# Altium project VOU_SOM_CV_V0.0.1.PrjPcb (part 1 of 2)
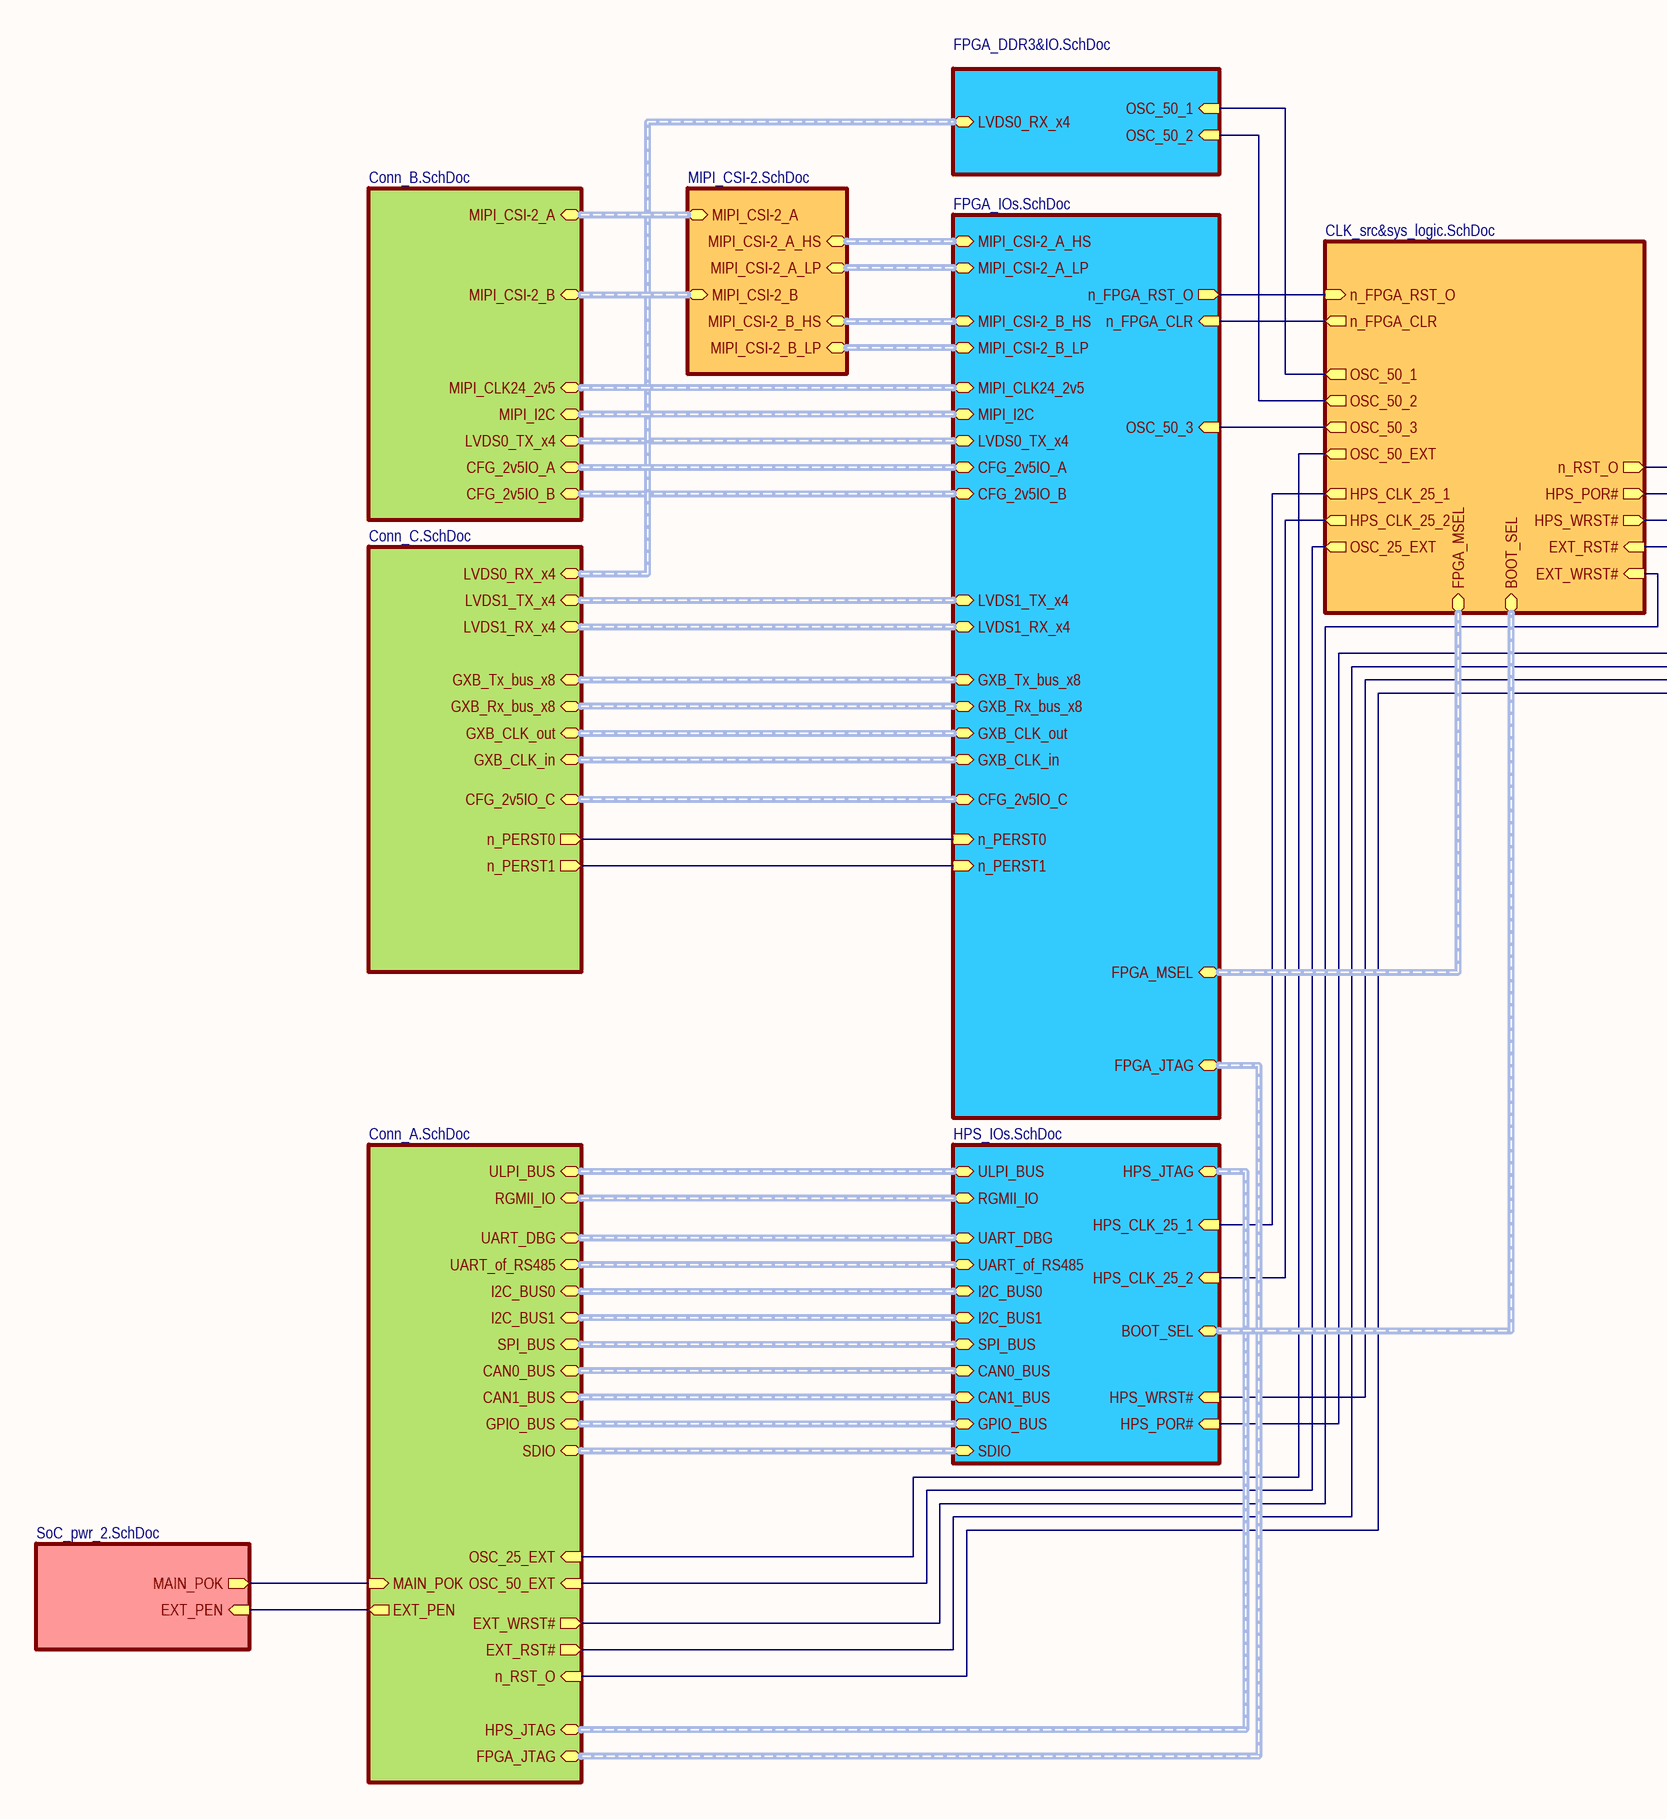
[diagram p0: VOU_SOM_CV_V0.0.1.SchDoc, left]
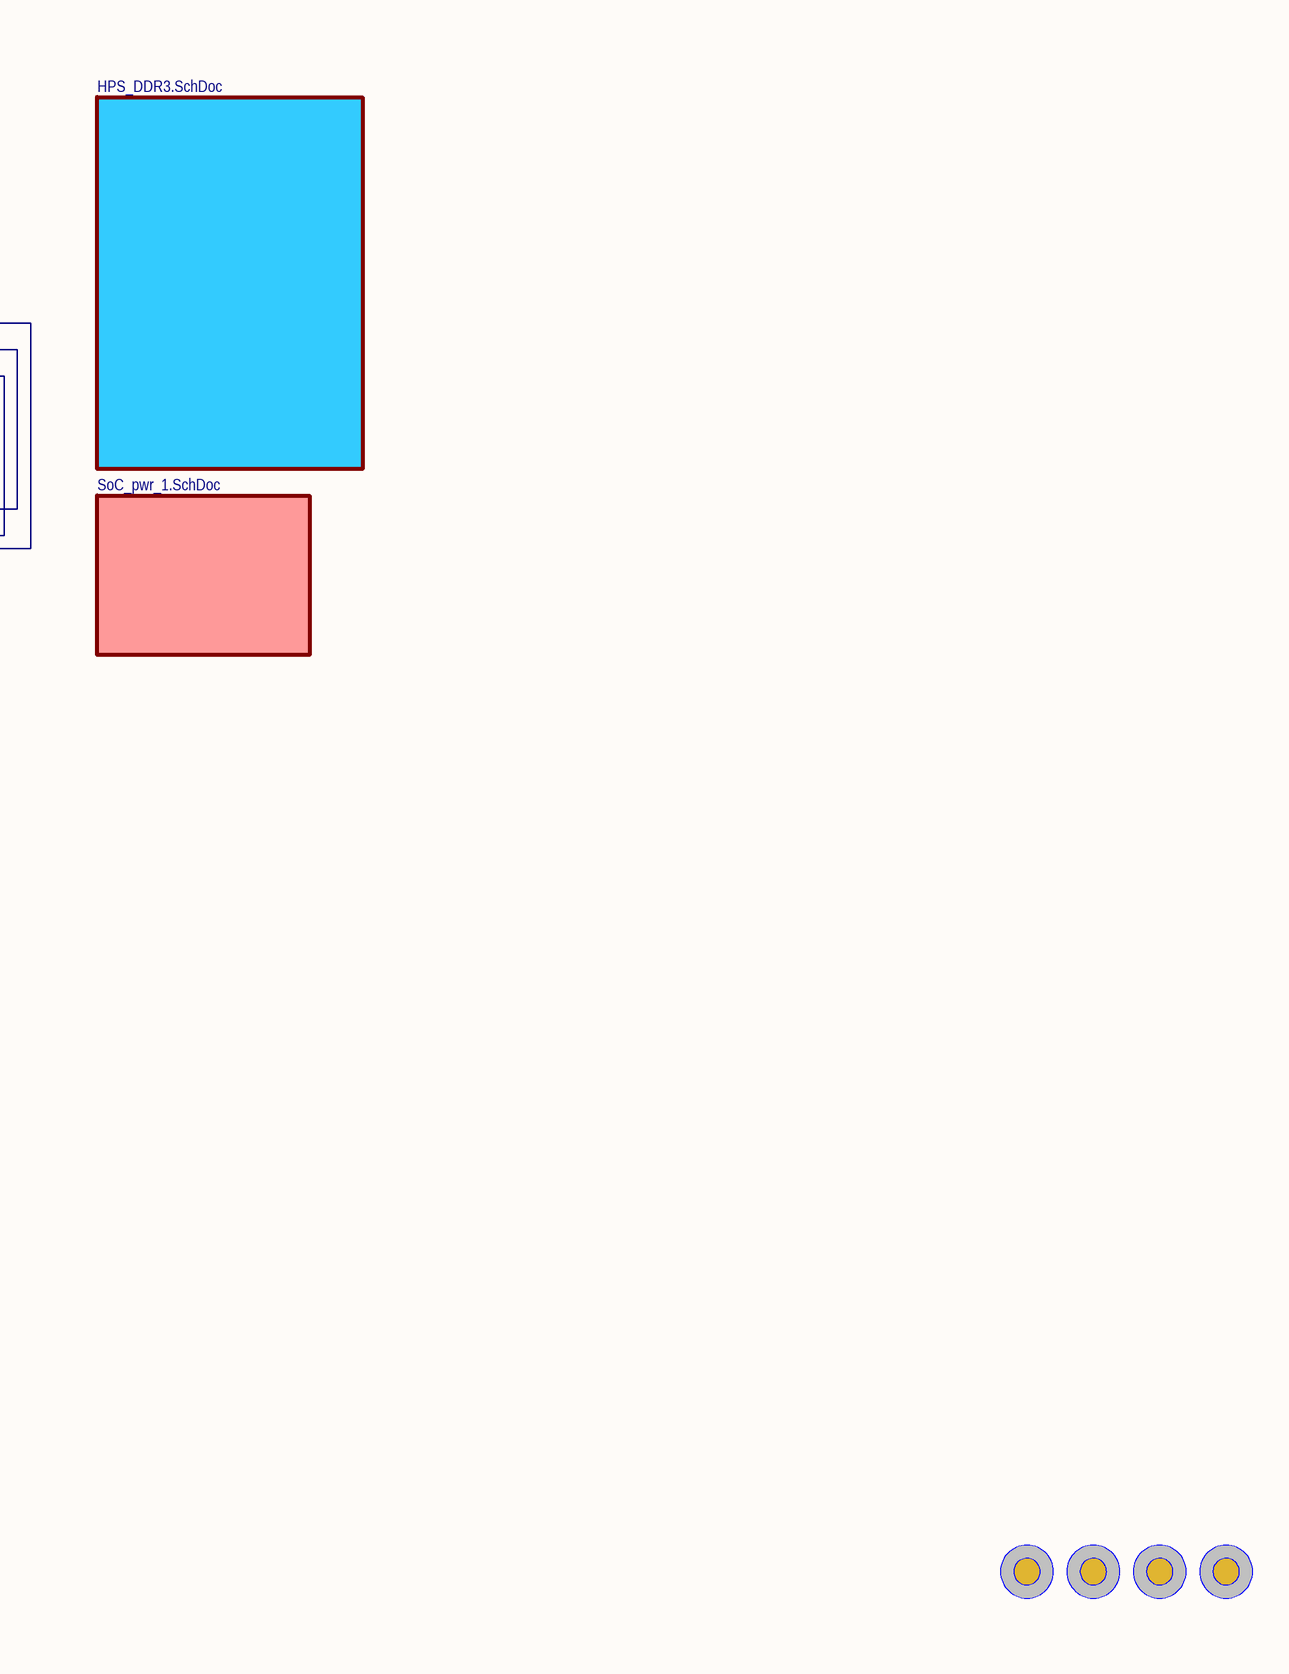
[diagram p1: VOU_SOM_CV_V0.0.1.SchDoc, right]
8 sheets, 208 parts. Net scope: hierarchical (ports join the sheet entries above them; power ports are global).
Board file: VOU_SOM_CV_V0.0.1.PcbDoc
Sheets:
  VOU_SOM_CV_V0.0.1.SchDoc
    FPGA_DDR3&IO.SchDoc = FPGA_DDR3&IO.SchDoc
    Conn_A.SchDoc = Conn_A.SchDoc
    Conn_B.SchDoc = Conn_B.SchDoc
    Conn_C.SchDoc = Conn_C.SchDoc
    HPS_DDR3.SchDoc = HPS_DDR3.SchDoc
    CLK_src&sys_logic.SchDoc = CLK_src&sys_logic.SchDoc
    SoC_pwr_2.SchDoc = SoC_pwr_2.SchDoc

## Sheet VOU_SOM_CV_V0.0.1.SchDoc
size 593 x 419 mm; DocumentNumber: 1; SheetNumber: 1; SheetTotal: 12; Razrabotal: Савицкий

### Parts
RP_BL  Comment  [Reper-Normal]  (value not drawn)  (no BOM)
RP_BR  Comment  [Reper-Normal]  (value not drawn)  (no BOM)
RP_LT  Comment  [Reper-Normal]  (value not drawn)  (no BOM)
RP_RT  Comment  [Reper-Normal]  (value not drawn)  (no BOM)

### Sub-sheets
CLK_src&sys_logic.SchDoc = CLK_src&sys_logic.SchDoc: HPS_CLK_25_1 (out), HPS_CLK_25_2 (out), OSC_50_1 (out), OSC_50_2 (out), OSC_50_3 (out), OSC_50_EXT (out), OSC_25_EXT (out), EXT_RST# (in), HPS_WRST# (out), HPS_POR# (out), FPGA_MSEL (harness FPGA_MSEL), BOOT_SEL (harness BOOT_SEL), n_FPGA_RST_O (in), n_FPGA_CLR (out), EXT_WRST# (in), n_RST_O (out)
Conn_A.SchDoc = Conn_A.SchDoc: MAIN_POK (in), EXT_PEN (out), ULPI_BUS (harness ULPI_BUS), RGMII_IO (harness RGMII_IO), UART_DBG (harness UART_DBG), UART_of_RS485 (harness UART_of_RS485), I2C_BUS0 (harness I2C_BUS0), I2C_BUS1 (harness I2C_BUS1), SPI_BUS (harness SPI_BUS), CAN0_BUS (harness CAN0_BUS), GPIO_BUS (harness GPIO_BUS), SDIO (harness SDIO), OSC_50_EXT (in), OSC_25_EXT (in), n_RST_O (in), HPS_JTAG (harness HPS_JTAG), FPGA_JTAG (harness FPGA_JTAG), EXT_RST# (out), EXT_WRST# (out), CAN1_BUS (harness CAN1_BUS)
Conn_B.SchDoc = Conn_B.SchDoc: MIPI_CSI-2_A (harness MIPI_CSI-2_A), MIPI_CSI-2_B (harness MIPI_CSI-2_B), LVDS0_TX_x4 (harness LVDS0_TX_x4), MIPI_I2C (harness MIPI_I2C), MIPI_CLK24_2v5 (harness MIPI_CLK24_2v5), CFG_2v5IO_A (harness CFG_2v5IO_A), CFG_2v5IO_B (harness CFG_2v5IO_B)
Conn_C.SchDoc = Conn_C.SchDoc: GXB_Tx_bus_x8 (harness GXB_Tx_bus_x8), GXB_Rx_bus_x8 (harness GXB_Rx_bus_x8), LVDS0_RX_x4 (harness LVDS0_RX_x4), LVDS1_TX_x4 (harness LVDS1_TX_x4), LVDS1_RX_x4 (harness LVDS1_RX_x4), GXB_CLK_out (harness GXB_CLK_out), GXB_CLK_in (harness GXB_CLK_in), CFG_2v5IO_С (harness CFG_2v5IO_С), n_PERST0 (out), n_PERST1 (out)
DIMS_DSP_MainBoard_Interface.SchDoc = MIPI_CSI-2.SchDoc (file not in this document): MIPI_CSI-2_B_HS (harness MIPI_CSI-2_B_HS), MIPI_CSI-2_B_LP (harness MIPI_CSI-2_B_LP), MIPI_CSI-2_A_HS (harness MIPI_CSI-2_A_HS), MIPI_CSI-2_A_LP (harness MIPI_CSI-2_A_LP), MIPI_CSI-2_A (harness MIPI_CSI-2_A), MIPI_CSI-2_B (harness MIPI_CSI-2_B)
FPGA_DDR3&IO.SchDoc = FPGA_DDR3&IO.SchDoc: OSC_50_1 (in), OSC_50_2 (in), LVDS0_RX_x4 (harness LVDS0_RX_x4)
FPGA_IOs.SchDoc = FPGA_IOs.SchDoc (file not in this document): MIPI_CSI-2_B_LP (harness MIPI_CSI-2_B_LP), MIPI_CSI-2_A_LP (harness MIPI_CSI-2_A_LP), MIPI_CSI-2_A_HS (harness MIPI_CSI-2_A_HS), CFG_2v5IO_B (harness CFG_2v5IO_B), GXB_Tx_bus_x8 (harness GXB_Tx_bus_x8), GXB_Rx_bus_x8 (harness GXB_Rx_bus_x8), GXB_CLK_out (harness GXB_CLK_out), FPGA_JTAG (harness FPGA_JTAG), FPGA_MSEL (harness FPGA_MSEL), OSC_50_3 (in), MIPI_CLK24_2v5 (harness MIPI_CLK24_2v5), MIPI_CSI-2_B_HS (harness MIPI_CSI-2_B_HS), MIPI_I2C (harness MIPI_I2C), LVDS0_TX_x4 (harness LVDS0_TX_x4), LVDS1_TX_x4 (harness LVDS1_TX_x4), LVDS1_RX_x4 (harness LVDS1_RX_x4), GXB_CLK_in (harness GXB_CLK_in), CFG_2v5IO_A (harness CFG_2v5IO_A), CFG_2v5IO_С (harness CFG_2v5IO_С), n_PERST0 (in), n_PERST1 (in), n_FPGA_RST_O (out), n_FPGA_CLR (in)
HPS_DDR3.SchDoc = HPS_DDR3.SchDoc: no entries
HPS_IOs.SchDoc = HPS_IOs.SchDoc (file not in this document): ULPI_BUS (harness ULPI_BUS), RGMII_IO (harness RGMII_IO), UART_DBG (harness UART_DBG), UART_of_RS485 (harness UART_of_RS485), I2C_BUS0 (harness I2C_BUS0), I2C_BUS1 (harness I2C_BUS1), SPI_BUS (harness SPI_BUS), CAN0_BUS (harness CAN0_BUS), GPIO_BUS (harness GPIO_BUS), HPS_JTAG (harness HPS_JTAG), SDIO (harness SDIO), HPS_CLK_25_1 (in), HPS_CLK_25_2 (in), HPS_WRST# (in), HPS_POR# (in), BOOT_SEL (harness BOOT_SEL), CAN1_BUS (harness CAN1_BUS)
SoC_pwr_1.SchDoc = SoC_pwr_1.SchDoc (file not in this document): no entries
SoC_pwr_2.SchDoc = SoC_pwr_2.SchDoc: MAIN_POK (out), EXT_PEN (in)

### Nets
EXT_PEN: sheet Conn_A.SchDoc/EXT_PEN, sheet SoC_pwr_2.SchDoc/EXT_PEN
EXT_RST#: sheet Conn_A.SchDoc/EXT_RST#, sheet CLK_src&sys_logic.SchDoc/EXT_RST#
HPS_WRST#: sheet HPS_IOs.SchDoc/HPS_WRST#, sheet CLK_src&sys_logic.SchDoc/HPS_WRST#
MAIN_POK: sheet Conn_A.SchDoc/MAIN_POK, sheet SoC_pwr_2.SchDoc/MAIN_POK
n_PERST0: sheet Conn_C.SchDoc/n_PERST0, sheet FPGA_IOs.SchDoc/n_PERST0
n_PERST1: sheet Conn_C.SchDoc/n_PERST1, sheet FPGA_IOs.SchDoc/n_PERST1
N_RST_O: sheet Conn_A.SchDoc/n_RST_O, sheet CLK_src&sys_logic.SchDoc/n_RST_O
NetC9_1: sheet FPGA_DDR3&IO.SchDoc/OSC_50_1, sheet CLK_src&sys_logic.SchDoc/OSC_50_1
NetC10_1: sheet FPGA_DDR3&IO.SchDoc/OSC_50_2, sheet CLK_src&sys_logic.SchDoc/OSC_50_2
NetD1_1: sheet FPGA_IOs.SchDoc/n_FPGA_RST_O, sheet CLK_src&sys_logic.SchDoc/n_FPGA_RST_O
NetR6_2: sheet FPGA_IOs.SchDoc/OSC_50_3, sheet CLK_src&sys_logic.SchDoc/OSC_50_3
NetR7_2: sheet Conn_A.SchDoc/OSC_25_EXT, sheet CLK_src&sys_logic.SchDoc/OSC_50_EXT
NetR9_2: sheet HPS_IOs.SchDoc/HPS_CLK_25_1, sheet CLK_src&sys_logic.SchDoc/HPS_CLK_25_1
NetR10_2: sheet HPS_IOs.SchDoc/HPS_CLK_25_2, sheet CLK_src&sys_logic.SchDoc/HPS_CLK_25_2
NetR11_2: sheet Conn_A.SchDoc/OSC_50_EXT, sheet CLK_src&sys_logic.SchDoc/OSC_25_EXT
NetR12_2: sheet HPS_IOs.SchDoc/HPS_POR#, sheet CLK_src&sys_logic.SchDoc/HPS_POR#
NetR13_1: sheet Conn_A.SchDoc/EXT_WRST#, sheet CLK_src&sys_logic.SchDoc/EXT_WRST#
NetR143_2: sheet FPGA_IOs.SchDoc/n_FPGA_CLR, sheet CLK_src&sys_logic.SchDoc/n_FPGA_CLR

### Buses and harness runs
harness sheet CLK_src&sys_logic.SchDoc/BOOT_SEL = sheet HPS_IOs.SchDoc/BOOT_SEL
harness sheet CLK_src&sys_logic.SchDoc/FPGA_MSEL = sheet FPGA_IOs.SchDoc/FPGA_MSEL
harness sheet Conn_A.SchDoc/CAN0_BUS = sheet HPS_IOs.SchDoc/CAN0_BUS
harness sheet Conn_A.SchDoc/CAN1_BUS = sheet HPS_IOs.SchDoc/CAN1_BUS
harness sheet Conn_A.SchDoc/FPGA_JTAG = sheet FPGA_IOs.SchDoc/FPGA_JTAG
harness sheet Conn_A.SchDoc/GPIO_BUS = sheet HPS_IOs.SchDoc/GPIO_BUS
harness sheet Conn_A.SchDoc/HPS_JTAG = sheet HPS_IOs.SchDoc/HPS_JTAG
harness sheet Conn_A.SchDoc/I2C_BUS0 = sheet HPS_IOs.SchDoc/I2C_BUS0
harness sheet Conn_A.SchDoc/I2C_BUS1 = sheet HPS_IOs.SchDoc/I2C_BUS1
harness sheet Conn_A.SchDoc/RGMII_IO = sheet HPS_IOs.SchDoc/RGMII_IO
harness sheet Conn_A.SchDoc/SDIO = sheet HPS_IOs.SchDoc/SDIO
harness sheet Conn_A.SchDoc/SPI_BUS = sheet HPS_IOs.SchDoc/SPI_BUS
harness sheet Conn_A.SchDoc/UART_DBG = sheet HPS_IOs.SchDoc/UART_DBG
harness sheet Conn_A.SchDoc/UART_of_RS485 = sheet HPS_IOs.SchDoc/UART_of_RS485
harness sheet Conn_A.SchDoc/ULPI_BUS = sheet HPS_IOs.SchDoc/ULPI_BUS
harness sheet Conn_B.SchDoc/CFG_2v5IO_A = sheet FPGA_IOs.SchDoc/CFG_2v5IO_A
harness sheet Conn_B.SchDoc/CFG_2v5IO_B = sheet FPGA_IOs.SchDoc/CFG_2v5IO_B
harness sheet Conn_B.SchDoc/LVDS0_TX_x4 = sheet FPGA_IOs.SchDoc/LVDS0_TX_x4
harness sheet Conn_B.SchDoc/MIPI_CLK24_2v5 = sheet FPGA_IOs.SchDoc/MIPI_CLK24_2v5
harness sheet Conn_B.SchDoc/MIPI_CSI-2_A = sheet DIMS_DSP_MainBoard_Interface.SchDoc/MIPI_CSI-2_A
harness sheet Conn_B.SchDoc/MIPI_CSI-2_B = sheet DIMS_DSP_MainBoard_Interface.SchDoc/MIPI_CSI-2_B
harness sheet Conn_B.SchDoc/MIPI_I2C = sheet FPGA_IOs.SchDoc/MIPI_I2C
harness sheet Conn_C.SchDoc/CFG_2v5IO_С = sheet FPGA_IOs.SchDoc/CFG_2v5IO_С
harness sheet Conn_C.SchDoc/GXB_CLK_in = sheet FPGA_IOs.SchDoc/GXB_CLK_in
harness sheet Conn_C.SchDoc/GXB_CLK_out = sheet FPGA_IOs.SchDoc/GXB_CLK_out
harness sheet Conn_C.SchDoc/GXB_Rx_bus_x8 = sheet FPGA_IOs.SchDoc/GXB_Rx_bus_x8
harness sheet Conn_C.SchDoc/GXB_Tx_bus_x8 = sheet FPGA_IOs.SchDoc/GXB_Tx_bus_x8
harness sheet Conn_C.SchDoc/LVDS0_RX_x4 = sheet FPGA_DDR3&IO.SchDoc/LVDS0_RX_x4
harness sheet Conn_C.SchDoc/LVDS1_RX_x4 = sheet FPGA_IOs.SchDoc/LVDS1_RX_x4
harness sheet Conn_C.SchDoc/LVDS1_TX_x4 = sheet FPGA_IOs.SchDoc/LVDS1_TX_x4
harness sheet DIMS_DSP_MainBoard_Interface.SchDoc/MIPI_CSI-2_A_HS = sheet FPGA_IOs.SchDoc/MIPI_CSI-2_A_HS
harness sheet DIMS_DSP_MainBoard_Interface.SchDoc/MIPI_CSI-2_A_LP = sheet FPGA_IOs.SchDoc/MIPI_CSI-2_A_LP
harness sheet DIMS_DSP_MainBoard_Interface.SchDoc/MIPI_CSI-2_B_HS = sheet FPGA_IOs.SchDoc/MIPI_CSI-2_B_HS
harness sheet DIMS_DSP_MainBoard_Interface.SchDoc/MIPI_CSI-2_B_LP = sheet FPGA_IOs.SchDoc/MIPI_CSI-2_B_LP

### Notes on the sheet
- Перв. примен.
- Справ. №
- Подп. и дата
- Инв. № дубл.
- Взам. инв. №
- Изм.
- Лист
- № докум.
- Подп.
- Дата
- Лит.
- Масса
- Масштаб
- Разраб.
- Пров.
- Т.контр.
- Схема электрическая принципиальная
- Листов
- Инв. № подл.
- Н.контр.
- Утв.
- Копировал:
- Формат А2

### Library data of the parts
RP_BL RP_BR RP_LT RP_RT = Reper: Стабилизатор положительного напряжения

## Sheet FPGA_DDR3&IO.SchDoc
size A1
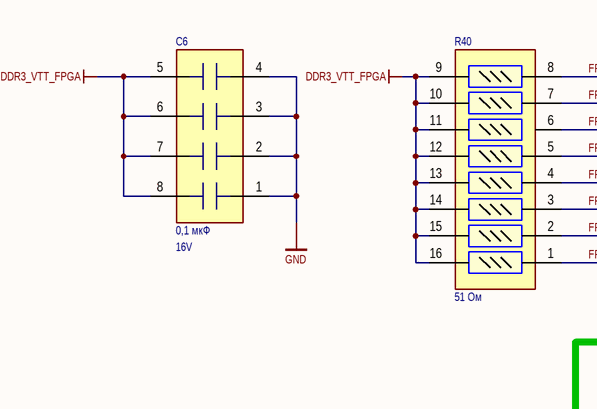
[diagram p2: FPGA_DDR3&IO.SchDoc, top left]
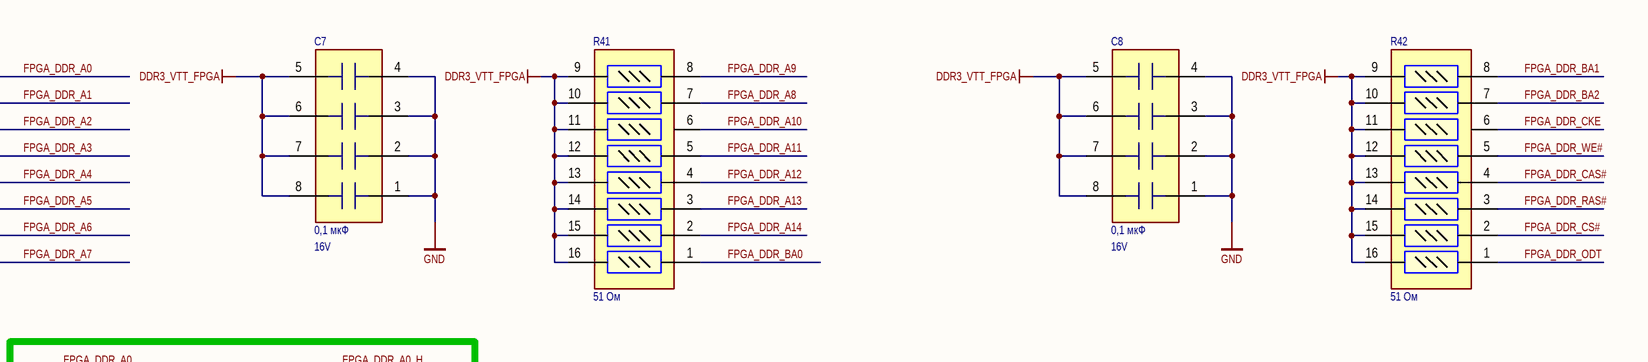
[diagram p3: FPGA_DDR3&IO.SchDoc, top right]
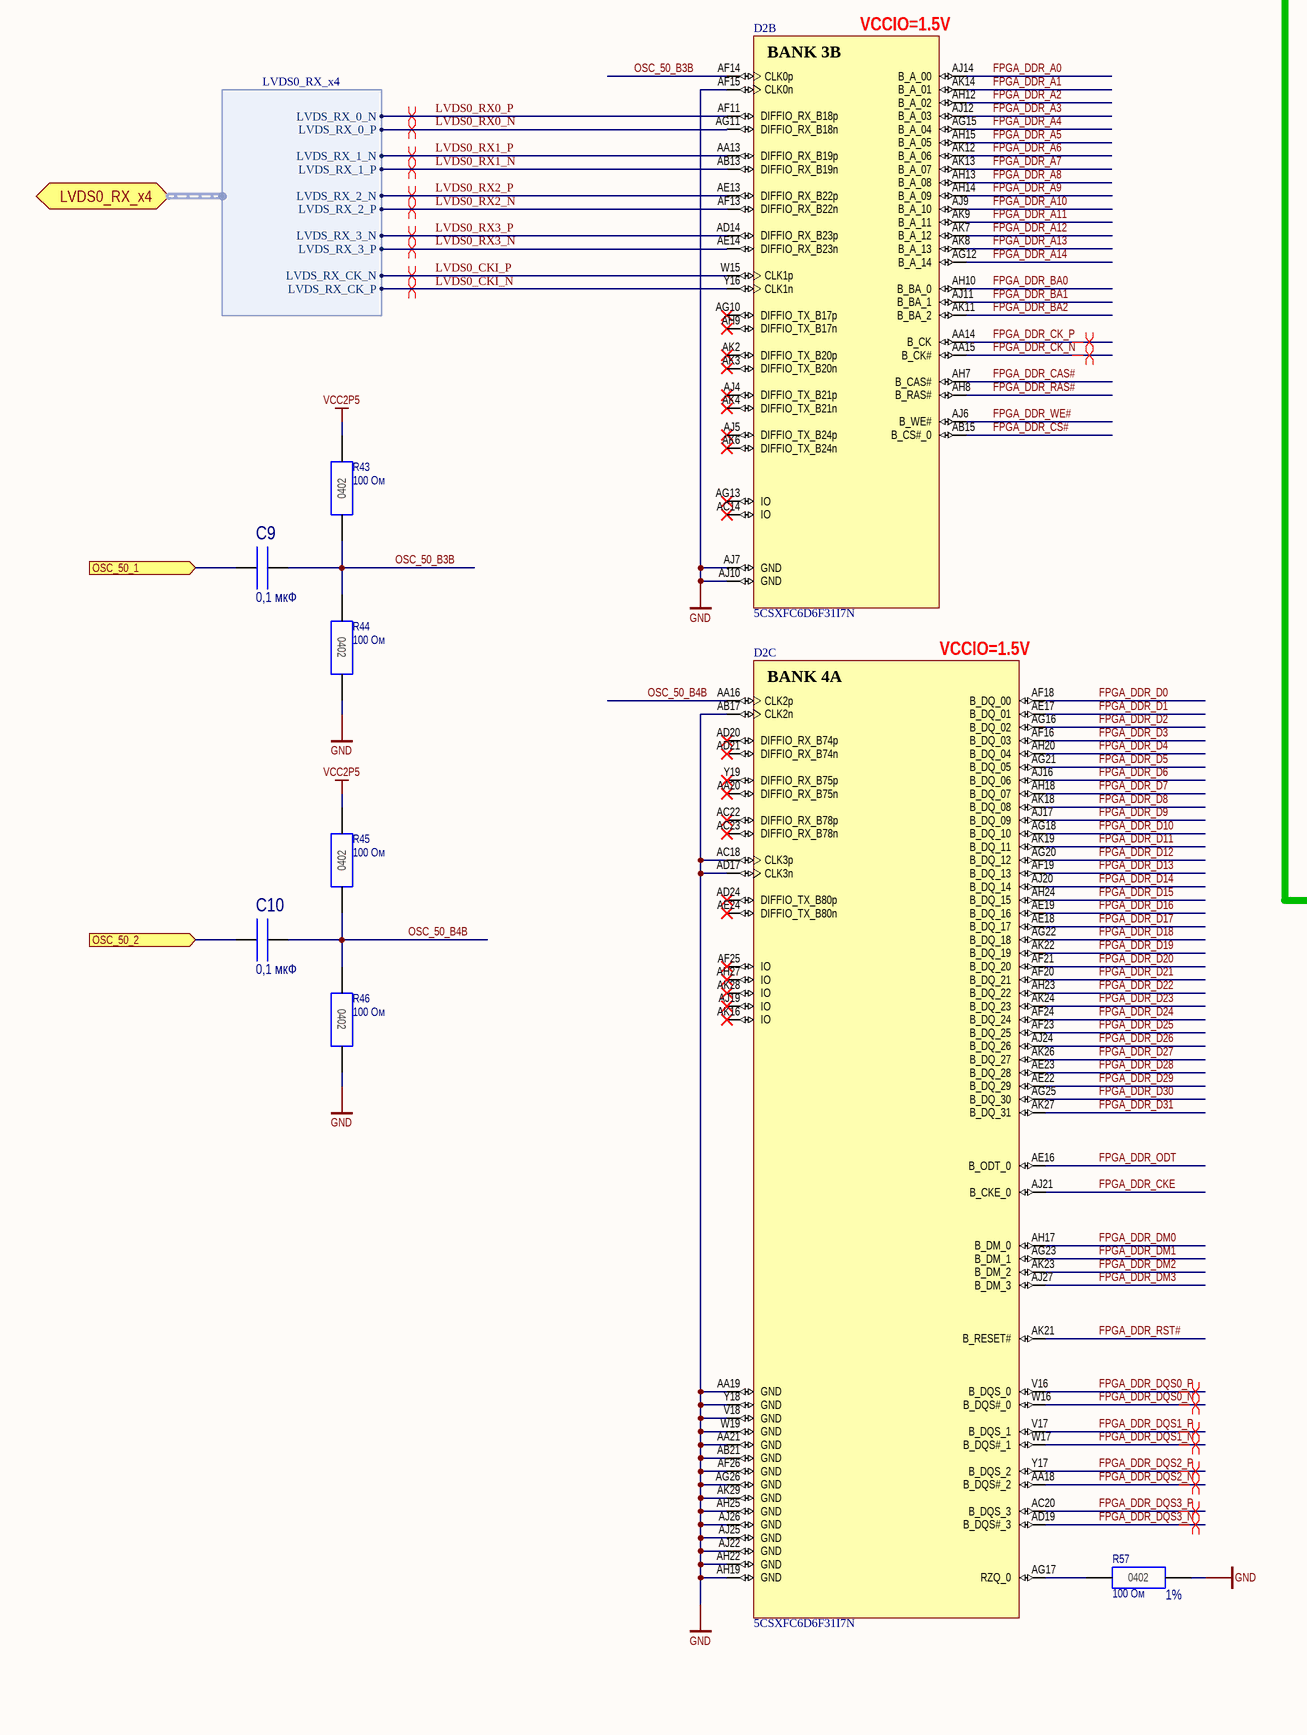
[diagram p4: FPGA_DDR3&IO.SchDoc, bottom left]
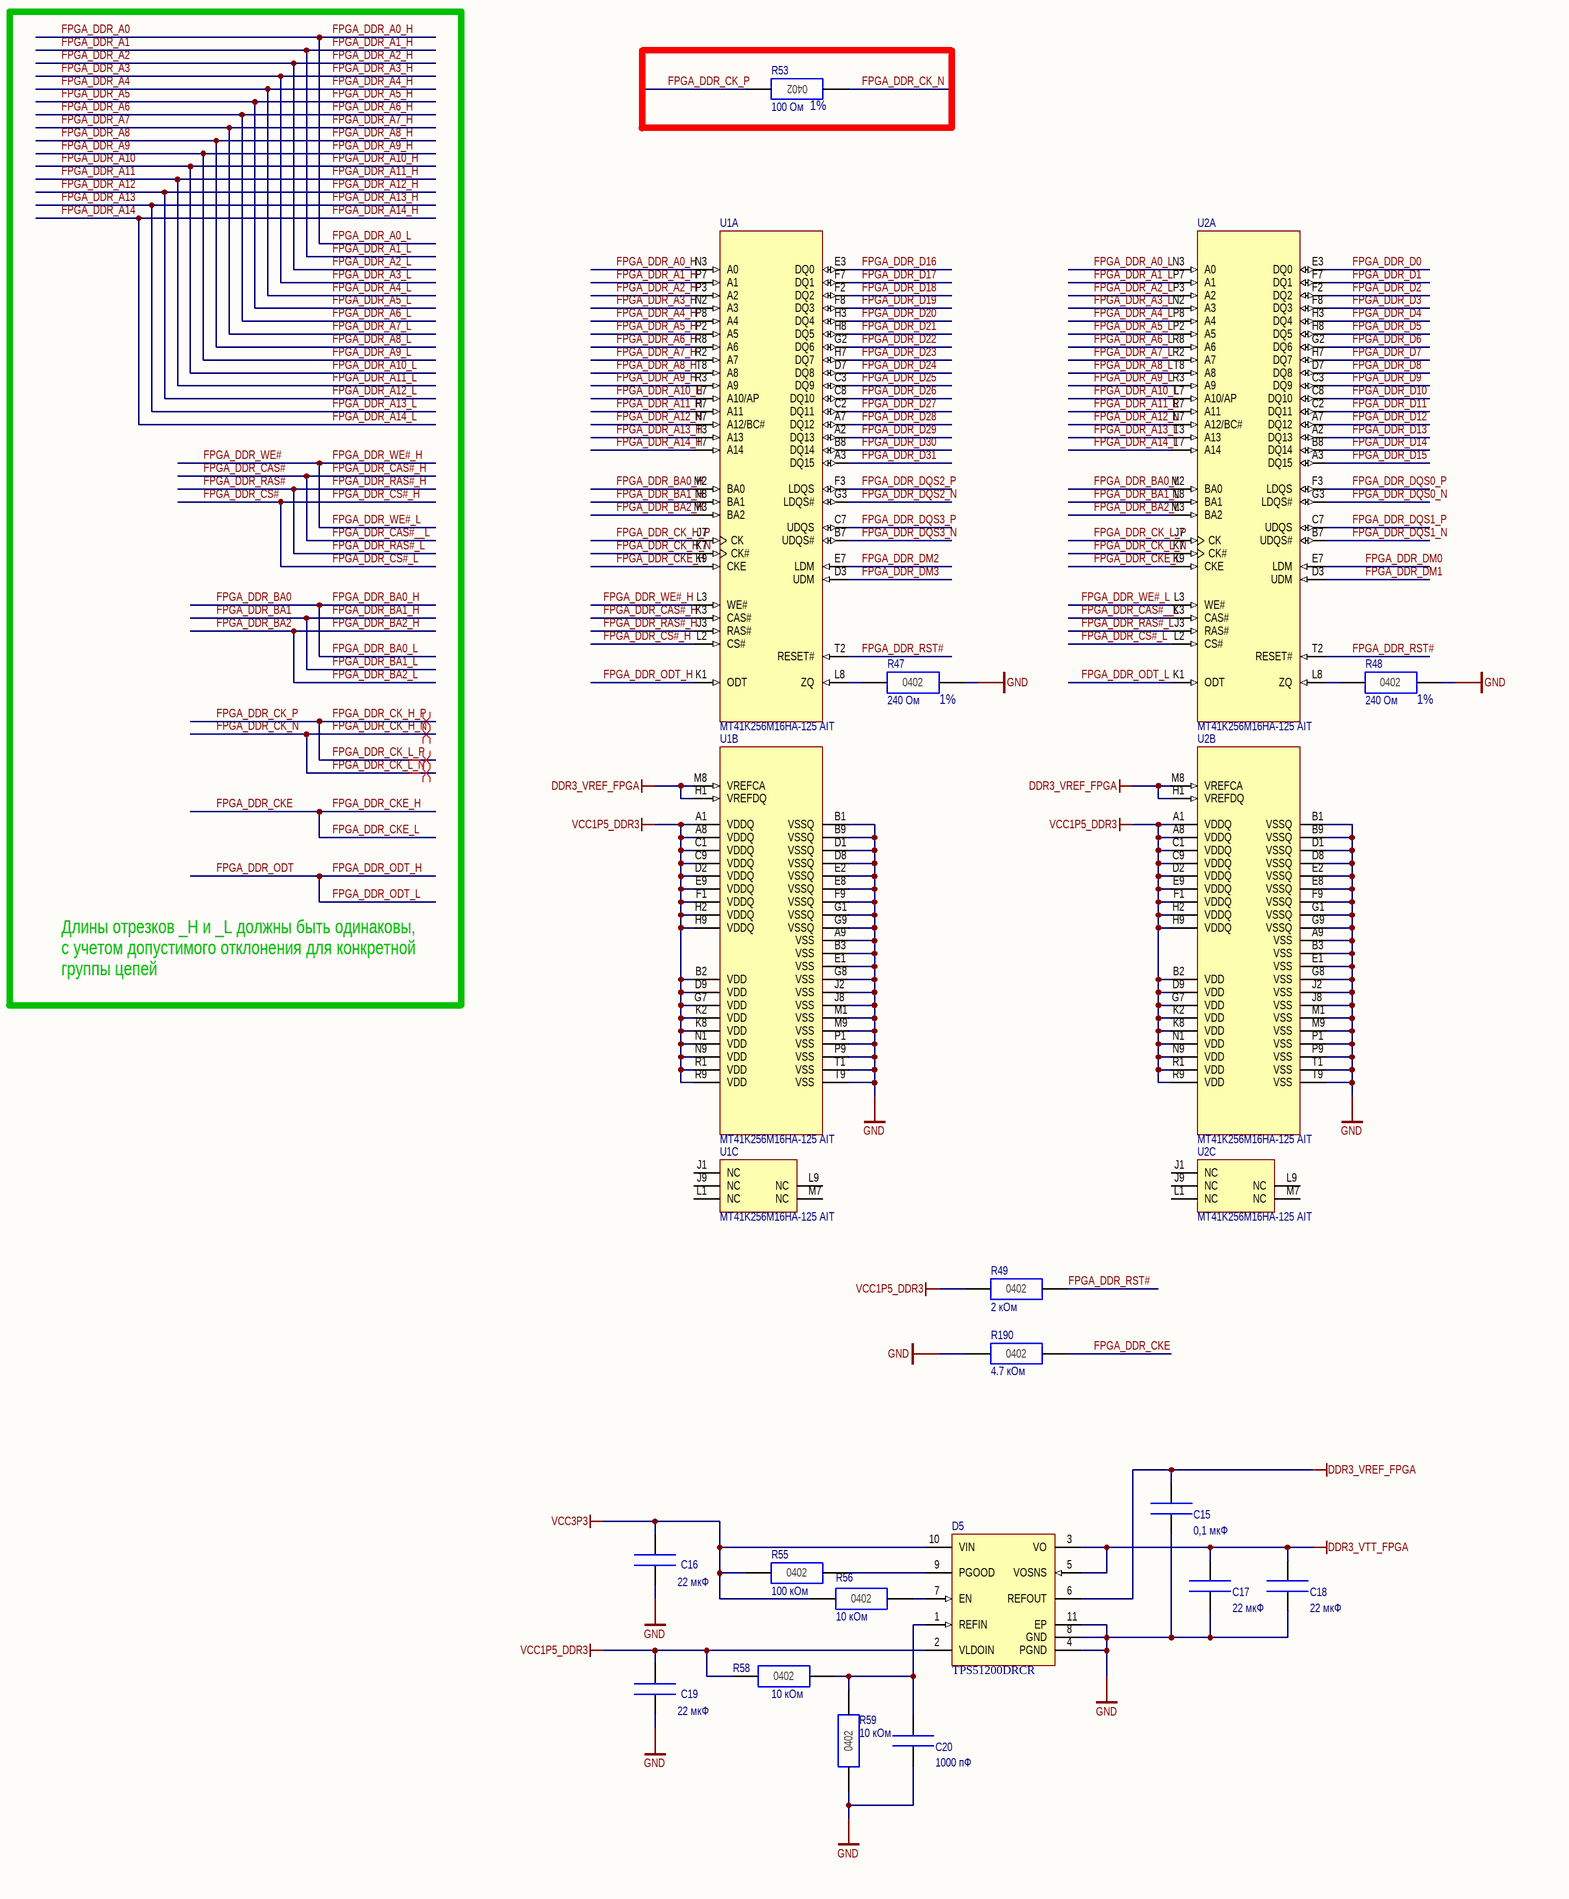
[diagram p5: FPGA_DDR3&IO.SchDoc, bottom right]

### Parts
C6  value 0,1 мкФ  V: 16V  [CAF-80P319X159-8N]  (hidden comment: W3A4YC104KAT2A)
C7  value 0,1 мкФ  V: 16V  [CAF-80P319X159-8N]  (hidden comment: W3A4YC104KAT2A)
C8  value 0,1 мкФ  V: 16V  [CAF-80P319X159-8N]  (hidden comment: W3A4YC104KAT2A)
C9  value 0,1 мкФ  [CC0402(1005)]  (hidden comment: CC0402-X7R-0,1 мкФ-20%-10В)
C10  value 0,1 мкФ  [CC0402(1005)]  (hidden comment: CC0402-X7R-0,1 мкФ-20%-10В)
C15  value 0,1 мкФ  [CC0402(1005)]  (hidden comment: CC0402-X7R-0,1 мкФ-20%-10В)
C16  value 22 мкФ  [CC0402(1005)]  (hidden comment: CC0402-X5R-22 мкФ-20%-6.3В)
C17  value 22 мкФ  [CC0402(1005)]  (hidden comment: CC0402-X5R-22 мкФ-20%-6.3В)
C18  value 22 мкФ  [CC0402(1005)]  (hidden comment: CC0402-X5R-22 мкФ-20%-6.3В)
C19  value 22 мкФ  [CC0402(1005)]  (hidden comment: CC0402-X5R-22 мкФ-20%-6.3В)
C20  value 1000 пФ  [CC0402(1005)]  (hidden comment: CC0402-NP01000 пФ-1%-50В)
D2  5CSXFC6D6F31I7N  [ALTR-FBGA896_A-200]  (parts B,C of 24)
D5  TPS51200DRCR  [TI-DRC10-2400X1650TP_V]
R40  value 51 Ом  [CAT16-J8]  (hidden comment: YC248-JR-07-51 Ом)
R41  value 51 Ом  [CAT16-J8]  (hidden comment: YC248-JR-07-51 Ом)
R42  value 51 Ом  [CAT16-J8]  (hidden comment: YC248-JR-07-51 Ом)
R43  value 100 Ом  [CR0402(1005)]  (hidden comment: CR0402-100 Ом-±5%)
R44  value 100 Ом  [CR0402(1005)]  (hidden comment: CR0402-100 Ом-±5%)
R45  value 100 Ом  [CR0402(1005)]  (hidden comment: CR0402-100 Ом-±5%)
R46  value 100 Ом  [CR0402(1005)]  (hidden comment: CR0402-100 Ом-±5%)
R47  value 240 Ом  TOLERANCE: 1%  [CR0402(1005)]  (hidden comment: CR0402-240 Ом-±TOLERANCE)
R48  value 240 Ом  TOLERANCE: 1%  [CR0402(1005)]  (hidden comment: CR0402-240 Ом-±TOLERANCE)
R49  value 2 кОм  [CR0402(1005)]  (hidden comment: CR0402-2 кОм-±5%)
R53  value 100 Ом  TOLERANCE: 1%  [CR0402(1005)]  (hidden comment: CR0402-100 Ом-±TOLERANCE)
R55  value 100 кОм  [CR0402(1005)]  (hidden comment: CR0402-100 кОм-±5%)
R56  value 10 кОм  [CR0402(1005)]  (hidden comment: CR0402-10 кОм-±5%)
R57  value 100 Ом  TOLERANCE: 1%  [CR0402(1005)]  (hidden comment: CR0402-100 Ом-±TOLERANCE)
R58  value 10 кОм  [CR0402(1005)]  (hidden comment: CR0402-10 кОм-±5%)
R59  value 10 кОм  [CR0402(1005)]  (hidden comment: CR0402-10 кОм-±5%)
R190  value 4.7 кОм  [CR0402(1005)]  (hidden comment: CR0402-4.7 кОм-±5%)
U1  MT41K256M16HA-125 AIT  [MICT-HA-96]  (parts A,B,C of 3)
U2  MT41K256M16HA-125 AIT  [MICT-HA-96]  (parts A,B,C of 3)

### Ports
LVDS0_RX_x4 (harness LVDS0_RX_x4), OSC_50_1 (in), OSC_50_2 (in)

### Harnesses
LVDS0_RX_x4: LVDS_RX_0_P, LVDS_RX_0_N, LVDS_RX_1_P, LVDS_RX_1_N, LVDS_RX_2_P, LVDS_RX_2_N, LVDS_RX_3_P, LVDS_RX_3_N, LVDS_RX_CK_P, LVDS_RX_CK_N

### Nets
DDR3_VREF_FPGA: C15.1(+) D5.6(REFOUT) U1.H1(VREFDQ) U1.M8(VREFCA) U2.H1(VREFDQ) U2.M8(VREFCA)
DDR3_VTT_FPGA: C6.5 C6.6 C6.7 C6.8 C7.5 C7.6 C7.7 C7.8 C8.5 C8.6 C8.7 C8.8 C17.1(+) C18.1(+) D5.3(VO) D5.5(VOSNS) R40.9 R40.10 R40.11 R40.12 R40.13 R40.14 R40.15 R40.16 R41.9 R41.10 R41.11 R41.12 R41.13 R41.14 R41.15 R41.16 R42.9 R42.10 R42.11 R42.12 R42.13 R42.14 R42.15 R42.16
GND: C6.1 C6.2 C6.3 C6.4 C7.1 C7.2 C7.3 C7.4 C8.1 C8.2 C8.3 C8.4 C15.2(-) C16.2(-) C17.2(-) C18.2(-) C19.2(-) C20.2(-) D2.AF15(CLK0n) D2.AJ7(GND) D2.AJ10(GND) D2.AJ22(GND) D5.4(PGND) D5.8(GND) D5.11(EP) R44.2(-) R46.2(-) R47.2(-) R48.2(-) R57.2(-) R59.1(+) R190.1(+) U1.A9(VSS) U1.B1(VSSQ) U1.B3(VSS) U1.B9(VSSQ) U1.D1(VSSQ) U1.D8(VSSQ) U1.E1(VSS) U1.E2(VSSQ) U1.E8(VSSQ) U1.F9(VSSQ) U1.G1(VSSQ) U1.G8(VSS) U1.G9(VSSQ) U1.J2(VSS) U1.J8(VSS) U1.M1(VSS) U1.M9(VSS) U1.P1(VSS) U1.P9(VSS) U1.T1(VSS) U1.T9(VSS) U2.A9(VSS) U2.B1(VSSQ) U2.B3(VSS) U2.B9(VSSQ) U2.D1(VSSQ) U2.D8(VSSQ) U2.E1(VSS) U2.E2(VSSQ) U2.E8(VSSQ) U2.F9(VSSQ) U2.G1(VSSQ) U2.G8(VSS) U2.G9(VSSQ) U2.J2(VSS) U2.J8(VSS) U2.M1(VSS) U2.M9(VSS) U2.P1(VSS) U2.P9(VSS) U2.T1(VSS) U2.T9(VSS)  [project net MIPI_CSI_CLKA_N]
VCC1P5_DDR3: C19.1(+) D5.2(VLDOIN) R49.1(+) R58.1(+) U1.A1(VDDQ) U1.A8(VDDQ) U1.B2(VDD) U1.C1(VDDQ) U1.C9(VDDQ) U1.D2(VDDQ) U1.D9(VDD) U1.E9(VDDQ) U1.F1(VDDQ) U1.G7(VDD) U1.H2(VDDQ) U1.H9(VDDQ) U1.K2(VDD) U1.K8(VDD) U1.N1(VDD) U1.N9(VDD) U1.R1(VDD) U1.R9(VDD) U2.A1(VDDQ) U2.A8(VDDQ) U2.B2(VDD) U2.C1(VDDQ) U2.C9(VDDQ) U2.D2(VDDQ) U2.D9(VDD) U2.E9(VDDQ) U2.F1(VDDQ) U2.G7(VDD) U2.H2(VDDQ) U2.H9(VDDQ) U2.K2(VDD) U2.K8(VDD) U2.N1(VDD) U2.N9(VDD) U2.R1(VDD) U2.R9(VDD)
VCC2P5: R43.2(-) R45.2(-)
VCC3P3: C16.1(+) D5.10(VIN) R55.1(+) R56.1(+)
FPGA_DDR_A0: D2.AJ14(B_A_00) R40.8 U1.N3(A0) U2.N3(A0)  [also labelled FPGA_DDR_A0_H, FPGA_DDR_A0_L]
FPGA_DDR_A1: D2.AK14(B_A_01) R40.7 U1.P7(A1) U2.P7(A1)  [also labelled FPGA_DDR_A1_H, FPGA_DDR_A1_L]
FPGA_DDR_A2: D2.AH12(B_A_02) R40.6 U1.P3(A2) U2.P3(A2)  [also labelled FPGA_DDR_A2_H, FPGA_DDR_A2_L]
FPGA_DDR_A3: D2.AJ12(B_A_03) R40.5 U1.N2(A3) U2.N2(A3)  [also labelled FPGA_DDR_A3_H, FPGA_DDR_A3_L]
FPGA_DDR_A4: D2.AG15(B_A_04) R40.4 U1.P8(A4) U2.P8(A4)  [also labelled FPGA_DDR_A4_H, FPGA_DDR_A4_L]
FPGA_DDR_A5: D2.AH15(B_A_05) R40.3 U1.P2(A5) U2.P2(A5)  [also labelled FPGA_DDR_A5_H, FPGA_DDR_A5_L]
FPGA_DDR_A6: D2.AK12(B_A_06) R40.2 U1.R8(A6) U2.R8(A6)  [also labelled FPGA_DDR_A6_H, FPGA_DDR_A6_L]
FPGA_DDR_A7: D2.AK13(B_A_07) R40.1 U1.R2(A7) U2.R2(A7)  [also labelled FPGA_DDR_A7_H, FPGA_DDR_A7_L]
FPGA_DDR_A8: D2.AH13(B_A_08) R41.7 U1.T8(A8) U2.T8(A8)  [also labelled FPGA_DDR_A8_H, FPGA_DDR_A8_L]
FPGA_DDR_A9: D2.AH14(B_A_09) R41.8 U1.R3(A9) U2.R3(A9)  [also labelled FPGA_DDR_A9_H, FPGA_DDR_A9_L]
FPGA_DDR_A10: D2.AJ9(B_A_10) R41.6 U1.L7(A10/AP) U2.L7(A10/AP)  [also labelled FPGA_DDR_A10_H, FPGA_DDR_A10_L]
FPGA_DDR_A11: D2.AK9(B_A_11) R41.5 U1.R7(A11) U2.R7(A11)  [also labelled FPGA_DDR_A11_H, FPGA_DDR_A11_L]
FPGA_DDR_A12: D2.AK7(B_A_12) R41.4 U1.N7(A12/BC#) U2.N7(A12/BC#)  [also labelled FPGA_DDR_A12_H, FPGA_DDR_A12_L]
FPGA_DDR_A13: D2.AK8(B_A_13) R41.3 U1.T3(A13) U2.T3(A13)  [also labelled FPGA_DDR_A13_H, FPGA_DDR_A13_L]
FPGA_DDR_A14: D2.AG12(B_A_14) R41.2 U1.T7(A14) U2.T7(A14)  [also labelled FPGA_DDR_A14_H, FPGA_DDR_A14_L]
FPGA_DDR_BA0: D2.AH10(B_BA_0) R41.1 U1.M2(BA0) U2.M2(BA0)  [also labelled FPGA_DDR_BA0_H, FPGA_DDR_BA0_L]
FPGA_DDR_BA1: D2.AJ11(B_BA_1) R42.8 U1.N8(BA1) U2.N8(BA1)  [also labelled FPGA_DDR_BA1_H, FPGA_DDR_BA1_L]
FPGA_DDR_BA2: D2.AK11(B_BA_2) R42.7 U1.M3(BA2) U2.M3(BA2)  [also labelled FPGA_DDR_BA2_H, FPGA_DDR_BA2_L]
FPGA_DDR_CAS#: D2.AH7(B_CAS#) R42.4 U1.K3(CAS#) U2.K3(CAS#)  [also labelled FPGA_DDR_CAS#__L, FPGA_DDR_CAS#_H]
FPGA_DDR_CK_H_N: D2.AA15(B_CK#) R53.1(+) U1.K7(CK#) U2.K7(CK#)  [also labelled FPGA_DDR_CK_L_N, FPGA_DDR_CK_N]
FPGA_DDR_CK_H_P: D2.AA14(B_CK) R53.2(-) U1.J7(CK) U2.J7(CK)  [also labelled FPGA_DDR_CK_L_P, FPGA_DDR_CK_P]
FPGA_DDR_CKE: D2.AJ21(B_CKE_0) R42.6 R190.2(-) U1.K9(CKE) U2.K9(CKE)  [also labelled FPGA_DDR_CKE_H, FPGA_DDR_CKE_L]
FPGA_DDR_CS#: D2.AB15(B_CS#_0) R42.2 U1.L2(CS#) U2.L2(CS#)  [also labelled FPGA_DDR_CS#_H, FPGA_DDR_CS#_L]
FPGA_DDR_D0: D2.AF18(B_DQ_00) U2.E3(DQ0)
FPGA_DDR_D1: D2.AE17(B_DQ_01) U2.F7(DQ1)
FPGA_DDR_D2: D2.AG16(B_DQ_02) U2.F2(DQ2)
FPGA_DDR_D3: D2.AF16(B_DQ_03) U2.F8(DQ3)
FPGA_DDR_D4: D2.AH20(B_DQ_04) U2.H3(DQ4)
FPGA_DDR_D5: D2.AG21(B_DQ_05) U2.H8(DQ5)
FPGA_DDR_D6: D2.AJ16(B_DQ_06) U2.G2(DQ6)
FPGA_DDR_D7: D2.AH18(B_DQ_07) U2.H7(DQ7)
FPGA_DDR_D8: D2.AK18(B_DQ_08) U2.D7(DQ8)
FPGA_DDR_D9: D2.AJ17(B_DQ_09) U2.C3(DQ9)
FPGA_DDR_D10: D2.AG18(B_DQ_10) U2.C8(DQ10)
FPGA_DDR_D11: D2.AK19(B_DQ_11) U2.C2(DQ11)
FPGA_DDR_D12: D2.AG20(B_DQ_12) U2.A7(DQ12)
FPGA_DDR_D13: D2.AF19(B_DQ_13) U2.A2(DQ13)
FPGA_DDR_D14: D2.AJ20(B_DQ_14) U2.B8(DQ14)
FPGA_DDR_D15: D2.AH24(B_DQ_15) U2.A3(DQ15)
FPGA_DDR_D16: D2.AE19(B_DQ_16) U1.E3(DQ0)
FPGA_DDR_D17: D2.AE18(B_DQ_17) U1.F7(DQ1)
FPGA_DDR_D18: D2.AG22(B_DQ_18) U1.F2(DQ2)
FPGA_DDR_D19: D2.AK22(B_DQ_19) U1.F8(DQ3)
FPGA_DDR_D20: D2.AF21(B_DQ_20) U1.H3(DQ4)
FPGA_DDR_D21: D2.AF20(B_DQ_21) U1.H8(DQ5)
FPGA_DDR_D22: D2.AH23(B_DQ_22) U1.G2(DQ6)
FPGA_DDR_D23: D2.AK24(B_DQ_23) U1.H7(DQ7)
FPGA_DDR_D24: D2.AF24(B_DQ_24) U1.D7(DQ8)
FPGA_DDR_D25: D2.AF23(B_DQ_25) U1.C3(DQ9)
FPGA_DDR_D26: D2.AJ24(B_DQ_26) U1.C8(DQ10)
FPGA_DDR_D27: D2.AK26(B_DQ_27) U1.C2(DQ11)
FPGA_DDR_D28: D2.AE23(B_DQ_28) U1.A7(DQ12)
FPGA_DDR_D29: D2.AE22(B_DQ_29) U1.A2(DQ13)
FPGA_DDR_D30: D2.AG25(B_DQ_30) U1.B8(DQ14)
FPGA_DDR_D31: D2.AK27(B_DQ_31) U1.A3(DQ15)
FPGA_DDR_DM0: D2.AH17(B_DM_0) U2.E7(LDM)
FPGA_DDR_DM1: D2.AG23(B_DM_1) U2.D3(UDM)
FPGA_DDR_DM2: D2.AK23(B_DM_2) U1.E7(LDM)
FPGA_DDR_DM3: D2.AJ27(B_DM_3) U1.D3(UDM)
FPGA_DDR_DQS0_N: D2.W16(B_DQS#_0) U2.G3(LDQS#)
FPGA_DDR_DQS0_P: D2.V16(B_DQS_0) U2.F3(LDQS)
FPGA_DDR_DQS1_N: D2.W17(B_DQS#_1) U2.B7(UDQS#)
FPGA_DDR_DQS1_P: D2.V17(B_DQS_1) U2.C7(UDQS)
FPGA_DDR_DQS2_N: D2.AA18(B_DQS#_2) U1.G3(LDQS#)
FPGA_DDR_DQS2_P: D2.Y17(B_DQS_2) U1.F3(LDQS)
FPGA_DDR_DQS3_N: D2.AD19(B_DQS#_3) U1.B7(UDQS#)
FPGA_DDR_DQS3_P: D2.AC20(B_DQS_3) U1.C7(UDQS)
FPGA_DDR_ODT: D2.AE16(B_ODT_0) R42.1 U1.K1(ODT) U2.K1(ODT)  [also labelled FPGA_DDR_ODT_H, FPGA_DDR_ODT_L]
FPGA_DDR_RAS#: D2.AH8(B_RAS#) R42.3 U1.J3(RAS#) U2.J3(RAS#)  [also labelled FPGA_DDR_RAS#_H, FPGA_DDR_RAS#_L]
FPGA_DDR_RST#: D2.AK21(B_RESET#) R49.2(-) U1.T2(RESET#) U2.T2(RESET#)
FPGA_DDR_WE#: D2.AJ6(B_WE#) R42.5 U1.L3(WE#) U2.L3(WE#)  [also labelled FPGA_DDR_WE#_H, FPGA_DDR_WE#_L]
LVDS0_CKI_N: D2.Y16(CLK1n) ; port LVDS0_RX_x4.LVDS_RX_CK_P
LVDS0_CKI_P: D2.W15(CLK1p) ; port LVDS0_RX_x4.LVDS_RX_CK_N
LVDS0_RX0_N: D2.AG11(DIFFIO_RX_B18n) ; port LVDS0_RX_x4.LVDS_RX_0_P
LVDS0_RX0_P: D2.AF11(DIFFIO_RX_B18p) ; port LVDS0_RX_x4.LVDS_RX_0_N
LVDS0_RX1_N: D2.AB13(DIFFIO_RX_B19n) ; port LVDS0_RX_x4.LVDS_RX_1_P
LVDS0_RX1_P: D2.AA13(DIFFIO_RX_B19p) ; port LVDS0_RX_x4.LVDS_RX_1_N
LVDS0_RX2_N: D2.AF13(DIFFIO_RX_B22n) ; port LVDS0_RX_x4.LVDS_RX_2_P
LVDS0_RX2_P: D2.AE13(DIFFIO_RX_B22p) ; port LVDS0_RX_x4.LVDS_RX_2_N
LVDS0_RX3_N: D2.AE14(DIFFIO_RX_B23n) ; port LVDS0_RX_x4.LVDS_RX_3_P
LVDS0_RX3_P: D2.AD14(DIFFIO_RX_B23p) ; port LVDS0_RX_x4.LVDS_RX_3_N
OSC_50_B3B: C9.2(-) D2.AF14(CLK0p) R43.1(+) R44.1(+)
OSC_50_B4B: C10.2(-) D2.AA16(CLK2p) R45.1(+) R46.1(+)
NetC9_1: C9.1(+) ; port OSC_50_1
NetC10_1: C10.1(+) ; port OSC_50_2
NetC20_1: C20.1(+) D5.1(REFIN) R58.2(-) R59.2(-)
NetD2_AG17: D2.AG17(RZQ_0) R57.1(+)
NetD5_7: D5.7(EN) R56.2(-)
NetD5_9: D5.9(PGOOD) R55.2(-)
NetR47_1: R47.1(+) U1.L8(ZQ)
NetR48_1: R48.1(+) U2.L8(ZQ)

Not connected (* = marked no-connect by the designer): D2 AA19(GND) AA20(DIFFIO_RX_B75n)* AA21(GND) AB17(CLK2n) AB21(GND) AC14(IO)* AC18(CLK3p) AC22(DIFFIO_RX_B78p)* AC23(DIFFIO_RX_B78n)* AD17(CLK3n) AD20(DIFFIO_RX_B74p)* AD21(DIFFIO_RX_B74n)* AD24(DIFFIO_TX_B80p)* AE24(DIFFIO_TX_B80n)* AF25(IO)* AF26(GND) AG10(DIFFIO_TX_B17p)* AG13(IO)* AG26(GND) AH9(DIFFIO_TX_B17n)* AH19(GND) AH22(GND) AH25(GND) AH27(IO)* AJ4(DIFFIO_TX_B21p)* AJ5(DIFFIO_TX_B24p)* AJ19(IO)* AJ25(GND) AJ26(GND) AK2(DIFFIO_TX_B20p)* AK3(DIFFIO_TX_B20n)* AK4(DIFFIO_TX_B21n)* AK6(DIFFIO_TX_B24n)* AK16(IO)* AK28(IO)* AK29(GND) V18(GND) W19(GND) Y18(GND) Y19(DIFFIO_RX_B75p)*; U1 J1(NC) J9(NC) L1(NC) L9(NC) M7(NC); U2 J1(NC) J9(NC) L1(NC) L9(NC) M7(NC)

### Layout directives
differential pair: FPGA_DDR_CK_H_N, FPGA_DDR_CK_H_P, FPGA_DDR_DQS0_N, FPGA_DDR_DQS0_P, FPGA_DDR_DQS1_N, FPGA_DDR_DQS1_P, FPGA_DDR_DQS2_N, FPGA_DDR_DQS2_P, FPGA_DDR_DQS3_N, FPGA_DDR_DQS3_P, LVDS0_CKI_N, LVDS0_CKI_P, LVDS0_RX0_N, LVDS0_RX0_P, LVDS0_RX1_N, LVDS0_RX1_P, LVDS0_RX2_N, LVDS0_RX2_P, LVDS0_RX3_N, LVDS0_RX3_P

### Notes on the sheet
- (near D2) VCCIO=1.5V
- Длины отрезков _H и _L должны быть одинаковы, с учетом допустимого отклонения для конкретной группы цепей
- (in symbol 5CSXFC6D6F31I7N, part B) BANK 3B
- (in symbol 5CSXFC6D6F31I7N, part C) BANK 4A
- (in symbol CR0402-#-±5%) 0402

### Library data of the parts
C6-C8 = W3A4YC104KAT2A: Чип конденсатор керамический; T: ±10%; TC: X7R; Supplier 1: Digi-Key; Supplier Part Number 1: 478-2879-2-ND
C9 C10 C15-C20 = CC0402-X7R-#-20%-10В: Чип конденсатор керамический; Supplier 1: Digi-Key
  C9 C10 C15: Supplier Part Number 1: 399-3520-1-ND
  C16-C19: Supplier Part Number 1: CC0402MRX5R4BB226
  C20: Supplier Part Number 1: GRM1555C1H102FA01D
D2 = 5CSXFC6D6F31I7N: Cyclone V SX Family FPGA, 1.07 to 1.13 V Supply, 288 I/O Pins, 6 PLLs, 896-Pin FBGA, Speed Grade 7, Industrial Grade, RoHS Compliant; Manufacturer: Altera; Logic Elements (LE) (K): 110; Speed Grade: 7; DatasheetVersion: Rev. 3.4; PackageVersion: Rev. 2.0, 12/2012; PackageReference: FBGA896_A-200; PackageDescription: 896-Pin FineLine Ball-Grid Array (FBGA), Body 31 x 31 mm, Pitch 1 mm; Supplier 1: Digi-Key; Supplier Part Number 1: 5CSXFC6D6F31I7N-ND; Supplier 2: Mouser; Supplier Part Number 2: 989-5CSXFC6D6F31I7N; Device Group: 5CSXFC6; RoHS: RoHS Compliant; Subcategory: Cyclone V SX; Voltage Supply: 1.07 to 1.13 V; NexusDeviceID: 5CSXFC6D6F31I7N; Mounting Technology: Surface Mount; Code_JEDEC: MS-034; PartNumber: 5CSXFC6D6F31I7N; ComponentLink1Description: Manufacturer URL; ComponentLink1URL: http://www.altera.com; ComponentLink2Description: Datasheet; ComponentLink2URL: http://www.altera.com/literature/hb/cyclone-v/cv_51002.pdf; ComponentLink3Description: Package Specification; ComponentLink3URL: http://www.altera.com/devicepackaging/04R00435-01.pdf; ComponentLink4Description: Device Handbook URL; ComponentLink4URL: http://www.altera.com/literature/hb/cyclone-v/cyclone5_handbook.pdf; ComponentLink5Description: Device Pin-Out URL; ComponentLink5URL: http://www.altera.com/literature/dp/cyclone-v/5CSXFC6.xls; ComponentLink6Description: Product URL; ComponentLink6URL: http://www.buyaltera.com/scripts/partsearch.dll?Detail&name=5CSXFC6D6F31I7N-ND
D5 = TPS51200DRCR: Single Output LDO, 3 A, 2.375 to 3.5 V Input, with DDR Termination, 10-pin SON (DRC), -40 to 85 degC, Green (RoHS & no Sb/Br); Manufacturer: Texas Instruments; Iout(Max)(A): 3; Iq(Typ)(mA): 0.5; Power Good: TRUE; Rating: Catalog; SubFamily: Single Channel LDO; Vin(Max)(V): 3.5; Vin(Min)(V): 2.3; DatasheetVersion: SLUS812; PackageVersion: 4204102-3/L; PackageReference: DRC10-2400X1650TP; PackageDescription: 10-Pin Plastic Small Outline, Body 3 x 3 mm, Pitch 0.5 mm; Supplier 1: Digi-Key; Supplier Part Number 1: 296-26978-2-ND; Supplier 2: Digi-Key; Supplier Part Number 2: 296-26978-1-ND; Supplier 3: Digi-Key; Supplier Part Number 3: 296-26978-6-ND; Supplier 4: Farnell; Supplier Part Number 4: 2126004; Supplier 5: Newark; Supplier Part Number 5: 94T5094; Supplier 6: Newark; Supplier Part Number 6: 11N9832; Supplier 7: Mouser; Supplier Part Number 7: 595-TPS51200DRCR; Eco-Plan: Green (RoHS & no Sb/Br); Mounting Technology: Surface Mount; PartNumber: TPS51200DRCR; ComponentLink1Description: Manufacturer URL; ComponentLink1URL: http://www.ti.com/; ComponentLink2Description: Datasheet; ComponentLink2URL: http://www.ti.com/general/docs/lit/getliterature.tsp?genericPartNumber=TPS51200&fileType=pdf; ComponentLink3Description: Package Specification; ComponentLink3URL: http://www.ti.com/litv/pdf/mpds117k; ComponentLink4Description: URL Link1; ComponentLink4URL: Samples URL:http://www.ti.com/product/tps51200#samples
R40-R42 = YC248-JR-07-#: Набор чип резисторов; P: 0.062 Вт; Supplier 1: Digi-Key; Supplier Part Number 1: YC248-JR-0751RL
R43-R46 R49 R55 R56 R58 R59 R190 = CR0402-#-±5%: Чип резистор; Maximum Working Voltage: 50 В; TOLERANCE: 5%; Supplier 1: Digi-Key
  R43-R46: Supplier Part Number 1: 311-100JRTR-ND
  R49: Supplier Part Number 1: 311-2.0KJRTR-ND
  R55: Supplier Part Number 1: 311-100KJRTR-ND
  R56 R58 R59: Supplier Part Number 1: 311-10.0KJRTR-ND
  R190: Supplier Part Number 1: 311-4.7KJRTR-ND
R47 R48 R53 R57 = CR0402-#-±5%: Чип резистор; Maximum Working Voltage: 50 В; Supplier 1: Digi-Key
  R47 R48: Supplier Part Number 1: 311-240JRTR-ND
  R53 R57: Supplier Part Number 1: 311-100JRTR-ND
U1 U2 = MT41K256M16HA-125 AIT: 4Gb DDR3-1600 SDRAM, 256Mb x 16, 1.25ns, 1.35V, -40 to 95 degC, 96-Ball FBGA, Pb-Free; Manufacturer: Micron; CL: CL = 11; Clock Rate: 800 MHz; Op. Temp.: -40C to +95C; DatasheetVersion: Rev. E; PackageVersion: Rev.E; PackageReference: MICT-HA-96; PackageDescription: 96-Ball Fine-Pitch Ball Grid Array, 14 x 9 mm, Pitch 0.8 mm; Cycle Time: 1.25ns; Data Rate: DDR3-1600; Density: 4Gb; Depth: 256Mb; Package: FBGA; Pin Count: 96-ball; RoHS: Yes; Voltage: 1.35V; Width: x16; Mounting Technology: Surface Mount; PartNumber: MT41K256M16HA-125 AIT; ComponentLink1Description: Manufacturer URL; ComponentLink1URL: http://www.micron.com/; ComponentLink2Description: Datasheet; ComponentLink2URL: http://www.micron.com/~/media/Documents/Products/Data%20Sheet/DRAM/4Gb_1_35V_DDR3L.pdf; ComponentLink3Description: Package Specification; ComponentLink3URL: http://www.micron.com/~/media/Documents/Products/Data%20Sheet/DRAM/4Gb_1_35V_DDR3L.pdf

## Sheet Conn_A.SchDoc
size A1
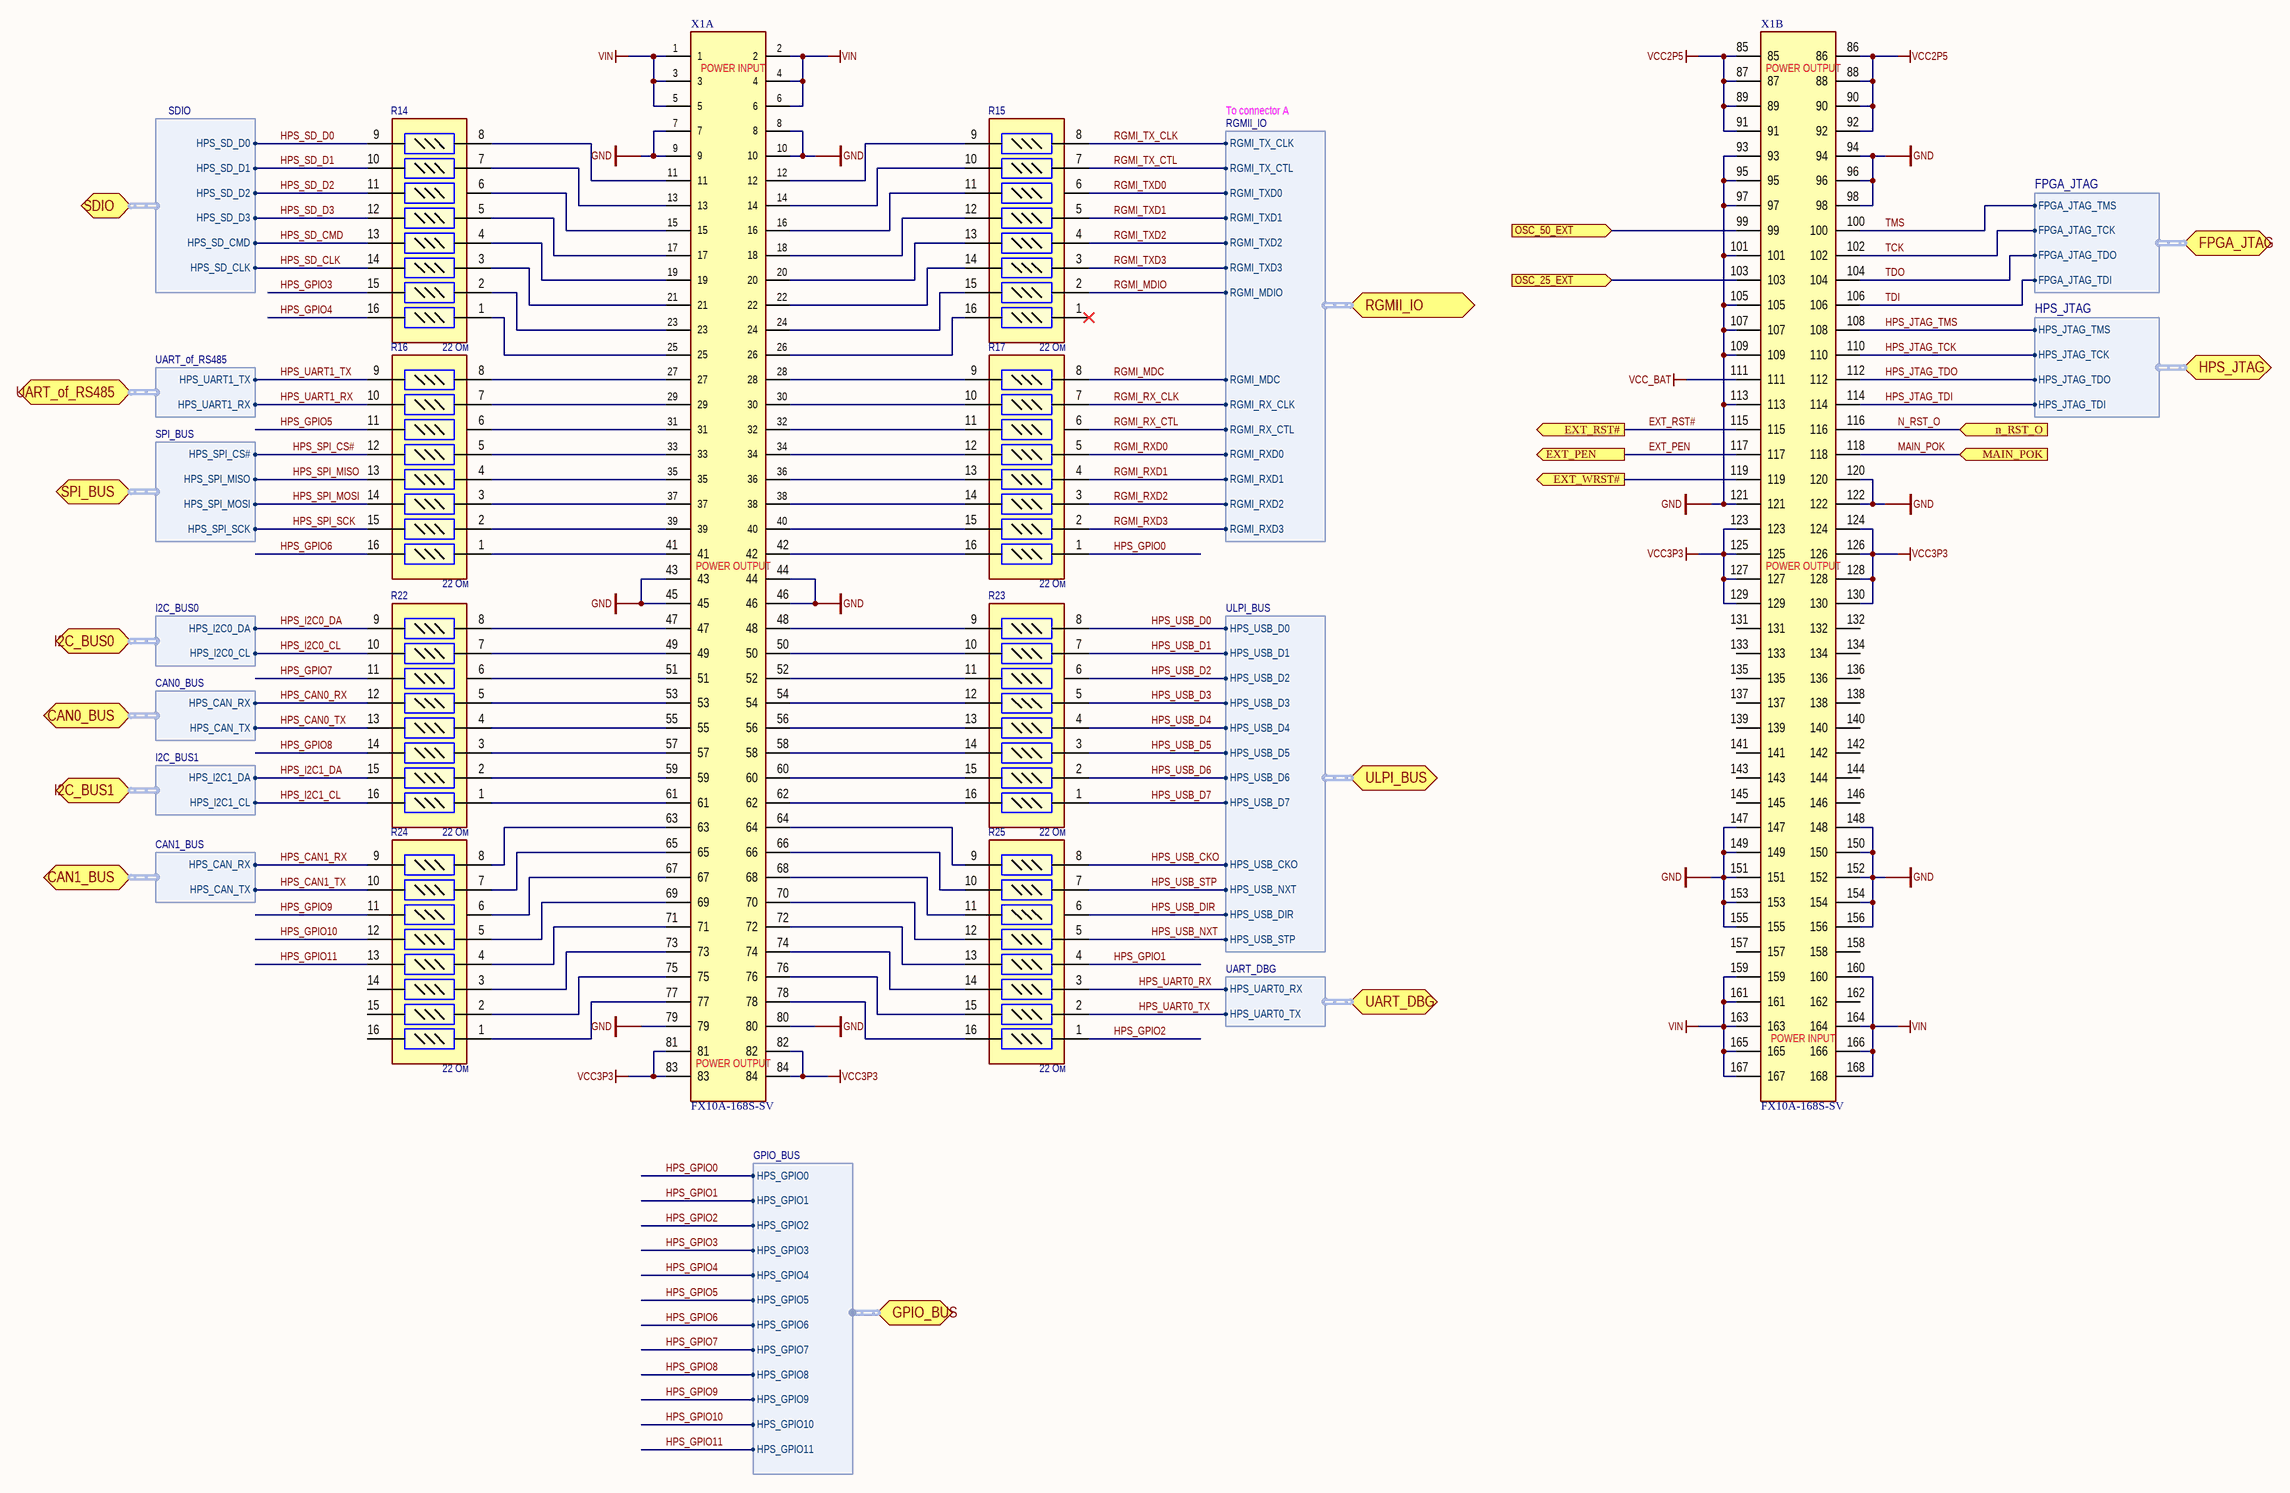
[diagram p6: Conn_A.SchDoc]

### Parts
R14  value 22 Ом  [CAT16-J8]  (hidden comment: YC248-JR-07-22 Ом)
R15  value 22 Ом  [CAT16-J8]  (hidden comment: YC248-JR-07-22 Ом)
R16  value 22 Ом  [CAT16-J8]  (hidden comment: YC248-JR-07-22 Ом)
R17  value 22 Ом  [CAT16-J8]  (hidden comment: YC248-JR-07-22 Ом)
R22  value 22 Ом  [CAT16-J8]  (hidden comment: YC248-JR-07-22 Ом)
R23  value 22 Ом  [CAT16-J8]  (hidden comment: YC248-JR-07-22 Ом)
R24  value 22 Ом  [CAT16-J8]  (hidden comment: YC248-JR-07-22 Ом)
R25  value 22 Ом  [CAT16-J8]  (hidden comment: YC248-JR-07-22 Ом)
X1  FX10A-168S-SV  [FX10A-168S-SV]  (parts A,B of 2)

### Ports
CAN0_BUS (harness CAN0_BUS), CAN1_BUS (harness CAN1_BUS), EXT_PEN (out), EXT_RST# (out), EXT_WRST# (out), FPGA_JTAG (harness FPGA_JTAG), GPIO_BUS (harness GPIO_BUS), HPS_JTAG (harness HPS_JTAG), I2C_BUS0 (harness I2C_BUS0), I2C_BUS1 (harness I2C_BUS1), MAIN_POK (in), n_RST_O (in), OSC_25_EXT (in), OSC_50_EXT (in), RGMII_IO (harness RGMII_IO), SDIO (harness SDIO), SPI_BUS (harness SPI_BUS), UART_DBG (harness UART_DBG), UART_of_RS485 (harness UART_of_RS485), ULPI_BUS (harness ULPI_BUS)

### Harnesses
SDIO: HPS_SD_D0, HPS_SD_D1, HPS_SD_D2, HPS_SD_D3, HPS_SD_CMD, HPS_SD_CLK
ULPI_BUS: HPS_USB_D0, HPS_USB_D1, HPS_USB_D2, HPS_USB_D3, HPS_USB_D4, HPS_USB_D5, HPS_USB_D6, HPS_USB_D7, HPS_USB_CKO, HPS_USB_NXT, HPS_USB_DIR, HPS_USB_STP
UART_DBG: HPS_UART0_RX, HPS_UART0_TX
UART_of_RS485: HPS_UART1_RX, HPS_UART1_TX
SPI_BUS: HPS_SPI_MOSI, HPS_SPI_MISO, HPS_SPI_SCK, HPS_SPI_CS#
I2C_BUS0: HPS_I2C0_DA, HPS_I2C0_CL
I2C_BUS1: HPS_I2C1_DA, HPS_I2C1_CL
CAN0_BUS: HPS_CAN_TX, HPS_CAN_RX
RGMII_IO: RGMI_TX_CLK, RGMI_TXD0, RGMI_TXD1, RGMI_TXD2, RGMI_TXD3, RGMI_RXD0, RGMI_RXD1, RGMI_RXD2, RGMI_RXD3, RGMI_TX_CTL, RGMI_RX_CTL, RGMI_RX_CLK, RGMI_MDIO, RGMI_MDC
HPS_JTAG: HPS_JTAG_TDI, HPS_JTAG_TDO, HPS_JTAG_TCK, HPS_JTAG_TMS
FPGA_JTAG: FPGA_JTAG_TDI, FPGA_JTAG_TDO, FPGA_JTAG_TCK, FPGA_JTAG_TMS
GPIO_BUS: HPS_GPIO0, HPS_GPIO1, HPS_GPIO2, HPS_GPIO3, HPS_GPIO4, HPS_GPIO5, HPS_GPIO6, HPS_GPIO7, HPS_GPIO8, HPS_GPIO9, HPS_GPIO10, HPS_GPIO11
CAN1_BUS: HPS_CAN_TX, HPS_CAN_RX

### Nets
GND: X1.7 X1.8 X1.9 X1.10 X1.43 X1.44 X1.45 X1.46 X1.79 X1.80 X1.93 X1.94 X1.95 X1.96 X1.97 X1.98 X1.101 X1.105 X1.107 X1.109 X1.113 X1.120 X1.121 X1.122 X1.147 X1.148 X1.149 X1.150 X1.151 X1.152 X1.153 X1.154 X1.155 X1.156  [project net MIPI_CSI_CLKA_N]
VCC2P5: X1.85 X1.86 X1.87 X1.88 X1.89 X1.90 X1.91 X1.92
VCC3P3: X1.81 X1.82 X1.83 X1.84 X1.123 X1.124 X1.125 X1.126 X1.127 X1.128 X1.129 X1.130
VCC_BAT: X1.111
VIN: X1.1 X1.2 X1.3 X1.4 X1.5 X1.6 X1.159 X1.160 X1.161 X1.163 X1.164 X1.165 X1.166 X1.167 X1.168
EXT_PEN: X1.117 ; port EXT_PEN
EXT_RST#: X1.115 ; port EXT_RST#
HPS_CAN0_RX: R22.12 ; port CAN0_BUS.HPS_CAN_RX
HPS_CAN0_TX: R22.13 ; port CAN0_BUS.HPS_CAN_TX
HPS_CAN1_RX: R24.9 ; port CAN1_BUS.HPS_CAN_RX
HPS_CAN1_TX: R24.10 ; port CAN1_BUS.HPS_CAN_TX
HPS_GPIO0: R17.1 ; port GPIO_BUS.HPS_GPIO0
HPS_GPIO1: R25.4 ; port GPIO_BUS.HPS_GPIO1
HPS_GPIO2: R25.1 ; port GPIO_BUS.HPS_GPIO2
HPS_GPIO3: R14.15 ; port GPIO_BUS.HPS_GPIO3
HPS_GPIO4: R14.16 ; port GPIO_BUS.HPS_GPIO4
HPS_GPIO5: R16.11 ; port GPIO_BUS.HPS_GPIO5
HPS_GPIO6: R16.16 ; port GPIO_BUS.HPS_GPIO6
HPS_GPIO7: R22.11 ; port GPIO_BUS.HPS_GPIO7
HPS_GPIO8: R22.14 ; port GPIO_BUS.HPS_GPIO8
HPS_GPIO9: R24.11 ; port GPIO_BUS.HPS_GPIO9
HPS_GPIO10: R24.12 ; port GPIO_BUS.HPS_GPIO10
HPS_GPIO11: R24.13 ; port GPIO_BUS.HPS_GPIO11
HPS_I2C0_CL: R22.10 ; port I2C_BUS0.HPS_I2C0_CL
HPS_I2C0_DA: R22.9 ; port I2C_BUS0.HPS_I2C0_DA
HPS_I2C1_CL: R22.16 ; port I2C_BUS1.HPS_I2C1_CL
HPS_I2C1_DA: R22.15 ; port I2C_BUS1.HPS_I2C1_DA
HPS_JTAG_TCK: X1.110 ; port HPS_JTAG.HPS_JTAG_TCK
HPS_JTAG_TDI: X1.114 ; port HPS_JTAG.HPS_JTAG_TDI
HPS_JTAG_TDO: X1.112 ; port HPS_JTAG.HPS_JTAG_TDO
HPS_JTAG_TMS: X1.108 ; port HPS_JTAG.HPS_JTAG_TMS
HPS_SD_CLK: R14.14 ; port SDIO.HPS_SD_CLK
HPS_SD_CMD: R14.13 ; port SDIO.HPS_SD_CMD
HPS_SD_D0: R14.9 ; port SDIO.HPS_SD_D0
HPS_SD_D1: R14.10 ; port SDIO.HPS_SD_D1
HPS_SD_D2: R14.11 ; port SDIO.HPS_SD_D2
HPS_SD_D3: R14.12 ; port SDIO.HPS_SD_D3
HPS_SPI_CS#: R16.12 ; port SPI_BUS.HPS_SPI_CS#
HPS_SPI_MISO: R16.13 ; port SPI_BUS.HPS_SPI_MISO
HPS_SPI_MOSI: R16.14 ; port SPI_BUS.HPS_SPI_MOSI
HPS_SPI_SCK: R16.15 ; port SPI_BUS.HPS_SPI_SCK
HPS_UART0_RX: R25.3 ; port UART_DBG.HPS_UART0_RX
HPS_UART0_TX: R25.2 ; port UART_DBG.HPS_UART0_TX
HPS_UART1_RX: R16.10 ; port UART_of_RS485.HPS_UART1_RX
HPS_UART1_TX: R16.9 ; port UART_of_RS485.HPS_UART1_TX
HPS_USB_CKO: R25.8 ; port ULPI_BUS.HPS_USB_CKO
HPS_USB_D0: R23.8 ; port ULPI_BUS.HPS_USB_D0
HPS_USB_D1: R23.7 ; port ULPI_BUS.HPS_USB_D1
HPS_USB_D2: R23.6 ; port ULPI_BUS.HPS_USB_D2
HPS_USB_D3: R23.5 ; port ULPI_BUS.HPS_USB_D3
HPS_USB_D4: R23.4 ; port ULPI_BUS.HPS_USB_D4
HPS_USB_D5: R23.3 ; port ULPI_BUS.HPS_USB_D5
HPS_USB_D6: R23.2 ; port ULPI_BUS.HPS_USB_D6
HPS_USB_D7: R23.1 ; port ULPI_BUS.HPS_USB_D7
HPS_USB_DIR: R25.6 ; port ULPI_BUS.HPS_USB_DIR
HPS_USB_NXT: R25.5 ; port ULPI_BUS.HPS_USB_STP
HPS_USB_STP: R25.7 ; port ULPI_BUS.HPS_USB_NXT
MAIN_POK: X1.118 ; port MAIN_POK
N_RST_O: X1.116 ; port n_RST_O
RGMI_MDC: R17.8 ; port RGMII_IO.RGMI_MDC
RGMI_MDIO: R15.2 ; port RGMII_IO.RGMI_MDIO
RGMI_RX_CLK: R17.7 ; port RGMII_IO.RGMI_RX_CLK
RGMI_RX_CTL: R17.6 ; port RGMII_IO.RGMI_RX_CTL
RGMI_RXD0: R17.5 ; port RGMII_IO.RGMI_RXD0
RGMI_RXD1: R17.4 ; port RGMII_IO.RGMI_RXD1
RGMI_RXD2: R17.3 ; port RGMII_IO.RGMI_RXD2
RGMI_RXD3: R17.2 ; port RGMII_IO.RGMI_RXD3
RGMI_TX_CLK: R15.8 ; port RGMII_IO.RGMI_TX_CLK
RGMI_TX_CTL: R15.7 ; port RGMII_IO.RGMI_TX_CTL
RGMI_TXD0: R15.6 ; port RGMII_IO.RGMI_TXD0
RGMI_TXD1: R15.5 ; port RGMII_IO.RGMI_TXD1
RGMI_TXD2: R15.4 ; port RGMII_IO.RGMI_TXD2
RGMI_TXD3: R15.3 ; port RGMII_IO.RGMI_TXD3
TCK: X1.102 ; port FPGA_JTAG.FPGA_JTAG_TCK
TDI: X1.106 ; port FPGA_JTAG.FPGA_JTAG_TDI
TDO: X1.104 ; port FPGA_JTAG.FPGA_JTAG_TDO
TMS: X1.100 ; port FPGA_JTAG.FPGA_JTAG_TMS
NetR7_2: X1.103 ; port OSC_25_EXT
NetR11_2: X1.99 ; port OSC_50_EXT
NetR13_1: X1.119 ; port EXT_WRST#
NetR14_1: R14.1 X1.25
NetR14_2: R14.2 X1.23
NetR14_3: R14.3 X1.21
NetR14_4: R14.4 X1.19
NetR14_5: R14.5 X1.17
NetR14_6: R14.6 X1.15
NetR14_7: R14.7 X1.13
NetR14_8: R14.8 X1.11
NetR15_9: R15.9 X1.12
NetR15_10: R15.10 X1.14
NetR15_11: R15.11 X1.16
NetR15_12: R15.12 X1.18
NetR15_13: R15.13 X1.20
NetR15_14: R15.14 X1.22
NetR15_15: R15.15 X1.24
NetR15_16: R15.16 X1.26
NetR16_1: R16.1 X1.41
NetR16_2: R16.2 X1.39
NetR16_3: R16.3 X1.37
NetR16_4: R16.4 X1.35
NetR16_5: R16.5 X1.33
NetR16_6: R16.6 X1.31
NetR16_7: R16.7 X1.29
NetR16_8: R16.8 X1.27
NetR17_9: R17.9 X1.28
NetR17_10: R17.10 X1.30
NetR17_11: R17.11 X1.32
NetR17_12: R17.12 X1.34
NetR17_13: R17.13 X1.36
NetR17_14: R17.14 X1.38
NetR17_15: R17.15 X1.40
NetR17_16: R17.16 X1.42
NetR22_1: R22.1 X1.61
NetR22_2: R22.2 X1.59
NetR22_3: R22.3 X1.57
NetR22_4: R22.4 X1.55
NetR22_5: R22.5 X1.53
NetR22_6: R22.6 X1.51
NetR22_7: R22.7 X1.49
NetR22_8: R22.8 X1.47
NetR23_9: R23.9 X1.48
NetR23_10: R23.10 X1.50
NetR23_11: R23.11 X1.52
NetR23_12: R23.12 X1.54
NetR23_13: R23.13 X1.56
NetR23_14: R23.14 X1.58
NetR23_15: R23.15 X1.60
NetR23_16: R23.16 X1.62
NetR24_1: R24.1 X1.77
NetR24_2: R24.2 X1.75
NetR24_3: R24.3 X1.73
NetR24_4: R24.4 X1.71
NetR24_5: R24.5 X1.69
NetR24_6: R24.6 X1.67
NetR24_7: R24.7 X1.65
NetR24_8: R24.8 X1.63
NetR25_9: R25.9 X1.64
NetR25_10: R25.10 X1.66
NetR25_11: R25.11 X1.68
NetR25_12: R25.12 X1.70
NetR25_13: R25.13 X1.72
NetR25_14: R25.14 X1.74
NetR25_15: R25.15 X1.76
NetR25_16: R25.16 X1.78

Not connected (* = marked no-connect by the designer): R15 1*; R24 14 15 16; X1 131 132 133 134 135 136 137 138 139 140 141 142 143 144 145 146 157 158 162

### Notes on the sheet
- (near X1) POWER INPUT
- To connector A
- (near X1) POWER OUTPUT

### Library data of the parts
R14-R17 R22-R25 = YC248-JR-07-#: Набор чип резисторов; P: 0.062 Вт; Supplier 1: Digi-Key; Supplier Part Number 1: YC248-JR-0722RL

## Sheet Conn_B.SchDoc
size A1
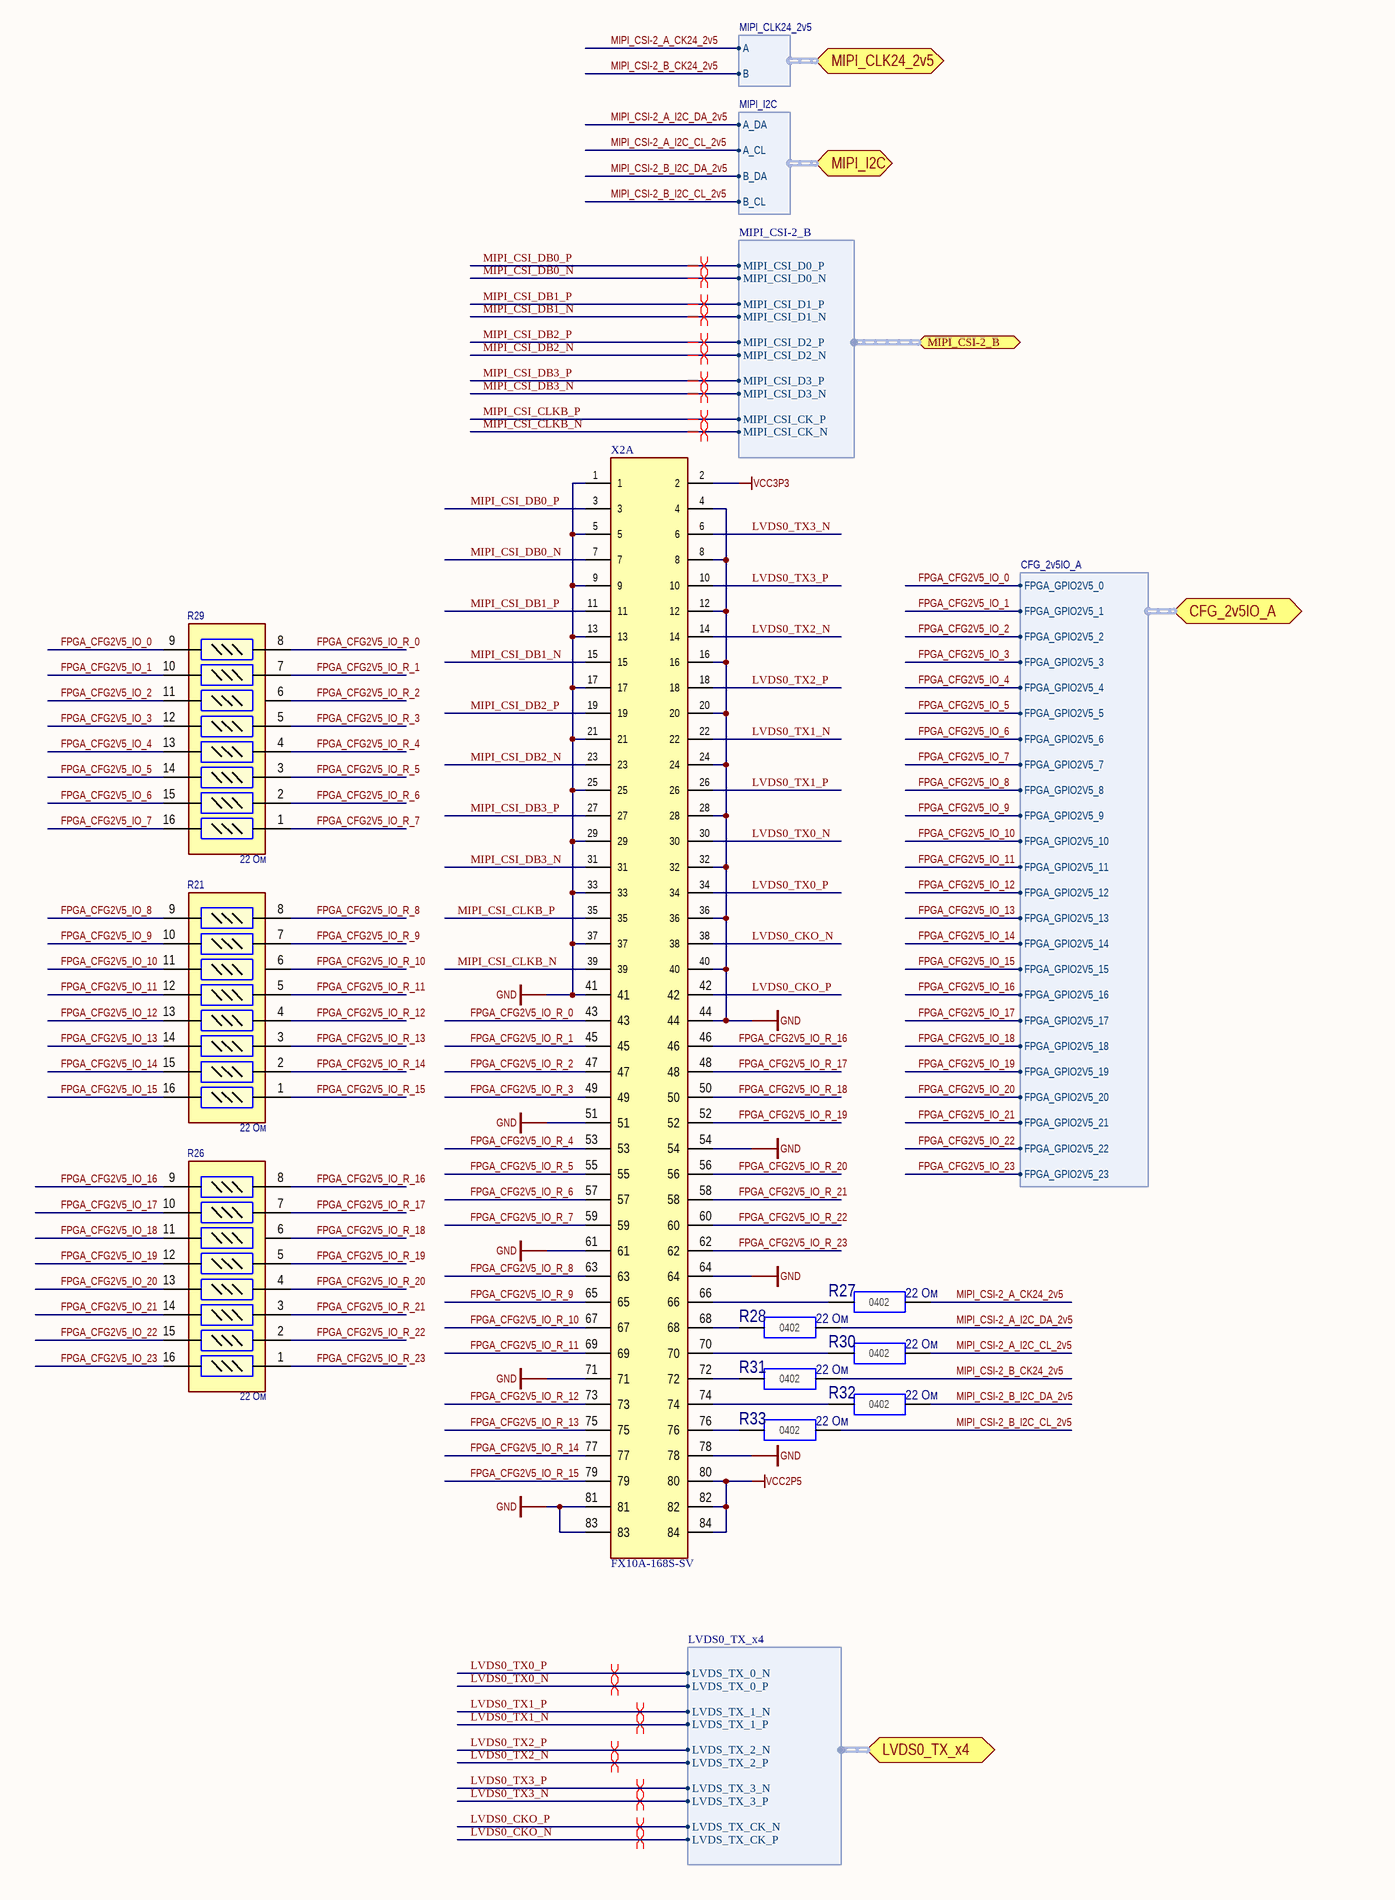
[diagram p7: Conn_B.SchDoc, left]
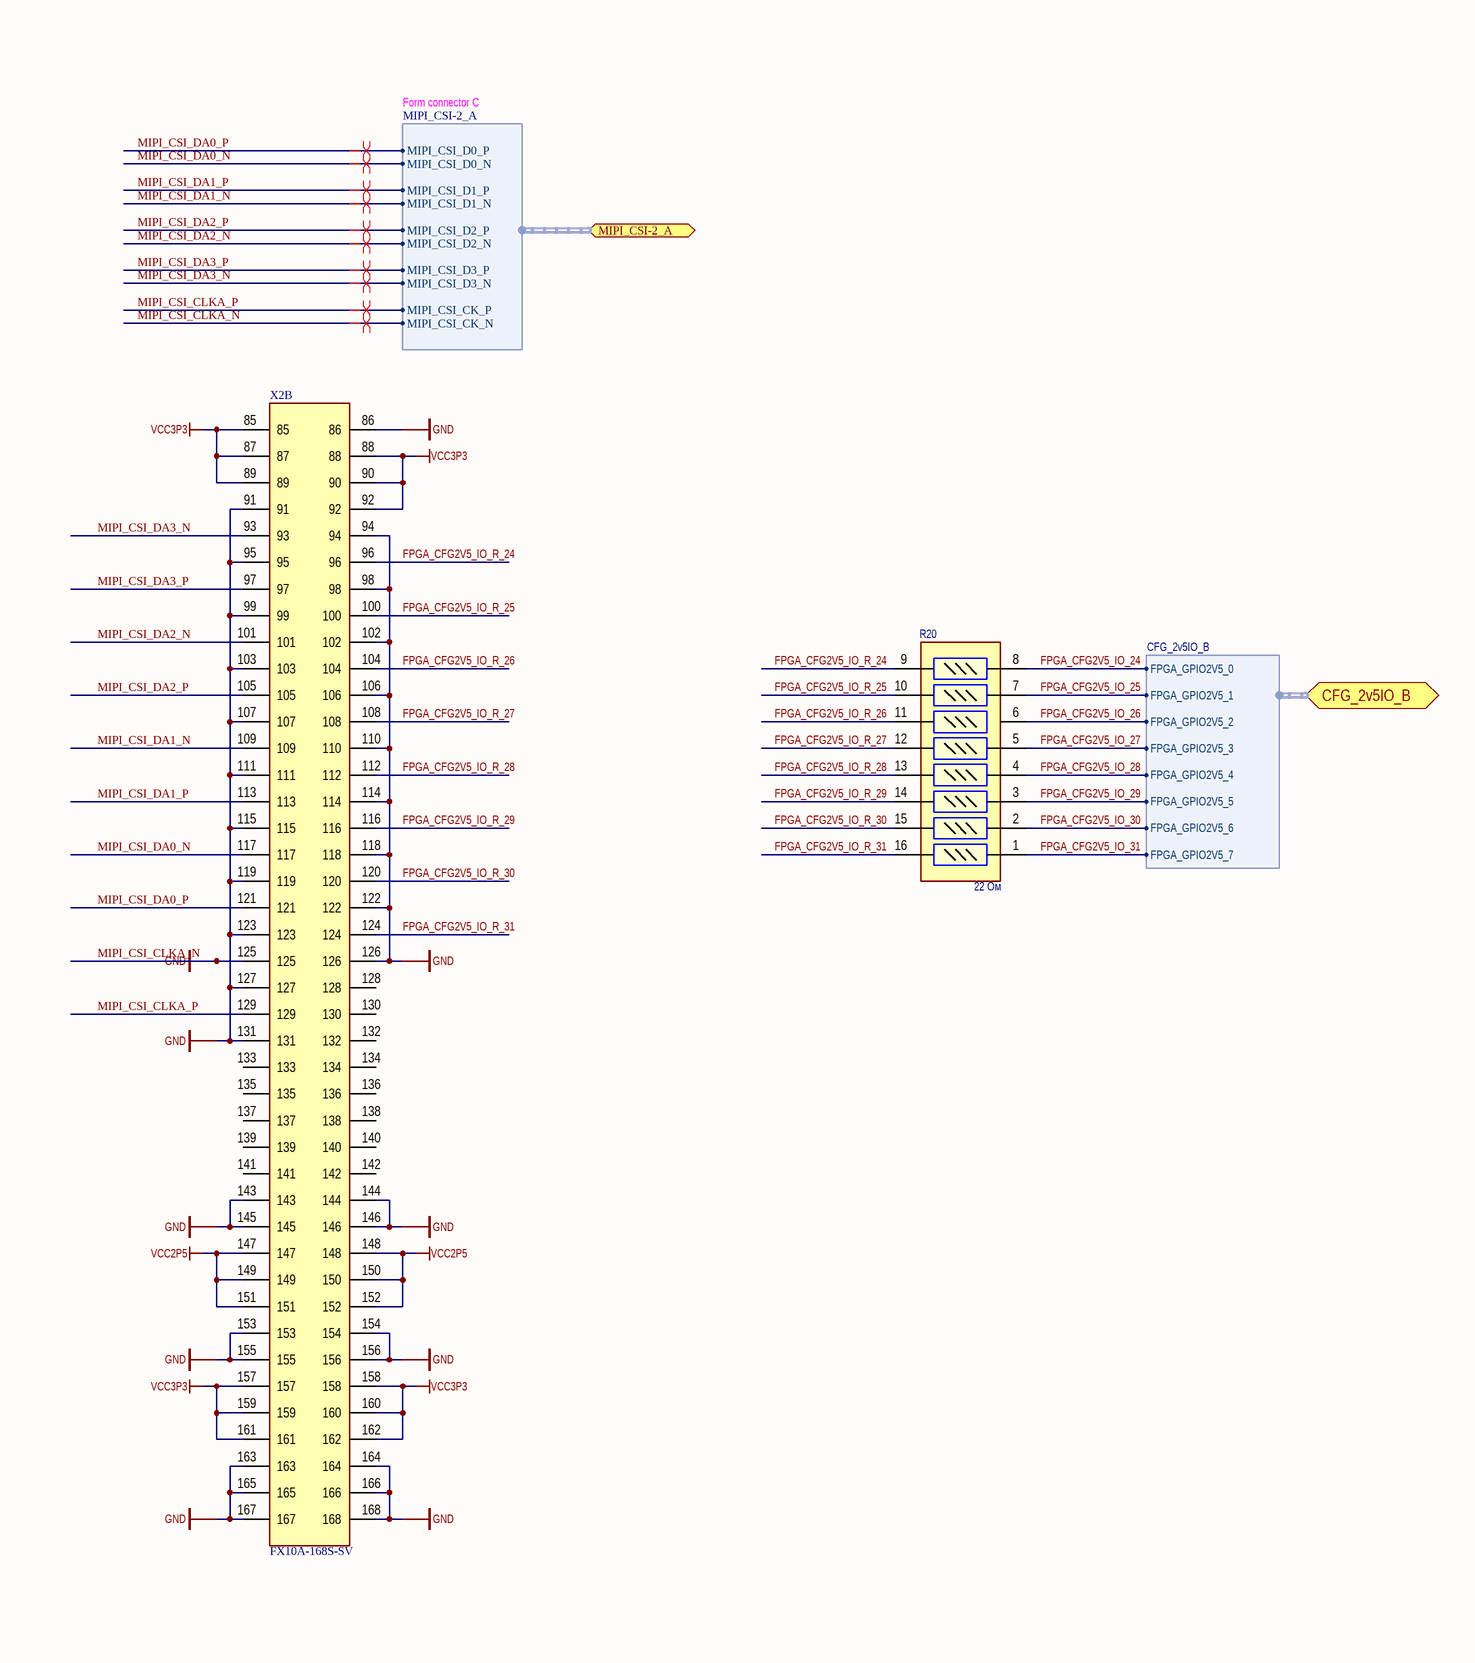
[diagram p8: Conn_B.SchDoc, right]

### Parts
R20  value 22 Ом  [CAT16-J8]  (hidden comment: YC248-JR-07-22 Ом)
R21  value 22 Ом  [CAT16-J8]  (hidden comment: YC248-JR-07-22 Ом)
R26  value 22 Ом  [CAT16-J8]  (hidden comment: YC248-JR-07-22 Ом)
R27  value 22 Ом  [CR0402(1005)]  (hidden comment: CR0402-22 Ом-±5%)
R28  value 22 Ом  [CR0402(1005)]  (hidden comment: CR0402-22 Ом-±5%)
R29  value 22 Ом  [CAT16-J8]  (hidden comment: YC248-JR-07-22 Ом)
R30  value 22 Ом  [CR0402(1005)]  (hidden comment: CR0402-22 Ом-±5%)
R31  value 22 Ом  [CR0402(1005)]  (hidden comment: CR0402-22 Ом-±5%)
R32  value 22 Ом  [CR0402(1005)]  (hidden comment: CR0402-22 Ом-±5%)
R33  value 22 Ом  [CR0402(1005)]  (hidden comment: CR0402-22 Ом-±5%)
X2  FX10A-168S-SV  [FX10A-168S-SV]  (parts A,B of 2)

### Ports
CFG_2v5IO_A (harness CFG_2v5IO_A), CFG_2v5IO_B (harness CFG_2v5IO_B), LVDS0_TX_x4 (harness LVDS0_TX_x4), MIPI_CLK24_2v5 (harness MIPI_CLK24_2v5), MIPI_CSI-2_A (harness MIPI_CSI-2_A), MIPI_CSI-2_B (harness MIPI_CSI-2_B), MIPI_I2C (harness MIPI_I2C)

### Harnesses
MIPI_CSI-2_A: MIPI_CSI_D0_N, MIPI_CSI_D0_P, MIPI_CSI_D1_N, MIPI_CSI_D1_P, MIPI_CSI_D2_P, MIPI_CSI_D2_N, MIPI_CSI_D3_N, MIPI_CSI_D3_P, MIPI_CSI_CK_N, MIPI_CSI_CK_P
MIPI_CSI-2_B: MIPI_CSI_D0_N, MIPI_CSI_D0_P, MIPI_CSI_D1_N, MIPI_CSI_D1_P, MIPI_CSI_D2_P, MIPI_CSI_D2_N, MIPI_CSI_D3_N, MIPI_CSI_D3_P, MIPI_CSI_CK_N, MIPI_CSI_CK_P
LVDS0_TX_x4: LVDS_TX_0_P, LVDS_TX_0_N, LVDS_TX_1_P, LVDS_TX_1_N, LVDS_TX_2_P, LVDS_TX_2_N, LVDS_TX_3_P, LVDS_TX_3_N, LVDS_TX_CK_P, LVDS_TX_CK_N
MIPI_CLK24_2v5: A, B
MIPI_I2C: A_DA, A_CL, B_DA, B_CL
CFG_2v5IO_A: FPGA_GPIO2V5_0, FPGA_GPIO2V5_1, FPGA_GPIO2V5_2, FPGA_GPIO2V5_3, FPGA_GPIO2V5_4, FPGA_GPIO2V5_5, FPGA_GPIO2V5_6, FPGA_GPIO2V5_7, FPGA_GPIO2V5_8, FPGA_GPIO2V5_9, FPGA_GPIO2V5_10, FPGA_GPIO2V5_11, FPGA_GPIO2V5_12, FPGA_GPIO2V5_13, FPGA_GPIO2V5_14, FPGA_GPIO2V5_15, FPGA_GPIO2V5_16, FPGA_GPIO2V5_17, FPGA_GPIO2V5_18, FPGA_GPIO2V5_19, FPGA_GPIO2V5_20, FPGA_GPIO2V5_21, FPGA_GPIO2V5_22, FPGA_GPIO2V5_23
CFG_2v5IO_B: FPGA_GPIO2V5_0, FPGA_GPIO2V5_1, FPGA_GPIO2V5_2, FPGA_GPIO2V5_3, FPGA_GPIO2V5_4, FPGA_GPIO2V5_5, FPGA_GPIO2V5_6, FPGA_GPIO2V5_7

### Nets
MIPI_CSI_CLKA_N: X2.1 X2.4 X2.5 X2.8 X2.9 X2.12 X2.13 X2.16 X2.17 X2.20 X2.21 X2.24 X2.25 X2.28 X2.29 X2.32 X2.33 X2.36 X2.37 X2.40 X2.41 X2.44 X2.51 X2.54 X2.61 X2.64 X2.71 X2.78 X2.81 X2.83 X2.86 X2.91 X2.94 X2.95 X2.98 X2.99 X2.102 X2.103 X2.106 X2.107 X2.110 X2.111 X2.114 X2.115 X2.118 X2.119 X2.122 X2.123 X2.125 X2.126 X2.127 X2.131 X2.143 X2.144 X2.145 X2.146 X2.153 X2.154 X2.155 X2.156 X2.163 X2.164 X2.165 X2.166 X2.167 X2.168 ; port MIPI_CSI-2_A.MIPI_CSI_CK_N  [also labelled GND]
VCC2P5: X2.80 X2.82 X2.84 X2.147 X2.148 X2.149 X2.150 X2.151 X2.152
VCC3P3: X2.2 X2.85 X2.87 X2.88 X2.89 X2.90 X2.92 X2.157 X2.158 X2.159 X2.160 X2.161 X2.162
FPGA_CFG2V5_IO_0: R29.9 ; port CFG_2v5IO_A.FPGA_GPIO2V5_0
FPGA_CFG2V5_IO_1: R29.10 ; port CFG_2v5IO_A.FPGA_GPIO2V5_1
FPGA_CFG2V5_IO_2: R29.11 ; port CFG_2v5IO_A.FPGA_GPIO2V5_2
FPGA_CFG2V5_IO_3: R29.12 ; port CFG_2v5IO_A.FPGA_GPIO2V5_3
FPGA_CFG2V5_IO_4: R29.13 ; port CFG_2v5IO_A.FPGA_GPIO2V5_4
FPGA_CFG2V5_IO_5: R29.14 ; port CFG_2v5IO_A.FPGA_GPIO2V5_5
FPGA_CFG2V5_IO_6: R29.15 ; port CFG_2v5IO_A.FPGA_GPIO2V5_6
FPGA_CFG2V5_IO_7: R29.16 ; port CFG_2v5IO_A.FPGA_GPIO2V5_7
FPGA_CFG2V5_IO_8: R21.9 ; port CFG_2v5IO_A.FPGA_GPIO2V5_8
FPGA_CFG2V5_IO_9: R21.10 ; port CFG_2v5IO_A.FPGA_GPIO2V5_9
FPGA_CFG2V5_IO_10: R21.11 ; port CFG_2v5IO_A.FPGA_GPIO2V5_10
FPGA_CFG2V5_IO_11: R21.12 ; port CFG_2v5IO_A.FPGA_GPIO2V5_11
FPGA_CFG2V5_IO_12: R21.13 ; port CFG_2v5IO_A.FPGA_GPIO2V5_12
FPGA_CFG2V5_IO_13: R21.14 ; port CFG_2v5IO_A.FPGA_GPIO2V5_13
FPGA_CFG2V5_IO_14: R21.15 ; port CFG_2v5IO_A.FPGA_GPIO2V5_14
FPGA_CFG2V5_IO_15: R21.16 ; port CFG_2v5IO_A.FPGA_GPIO2V5_15
FPGA_CFG2V5_IO_16: R26.9 ; port CFG_2v5IO_A.FPGA_GPIO2V5_16
FPGA_CFG2V5_IO_17: R26.10 ; port CFG_2v5IO_A.FPGA_GPIO2V5_17
FPGA_CFG2V5_IO_18: R26.11 ; port CFG_2v5IO_A.FPGA_GPIO2V5_18
FPGA_CFG2V5_IO_19: R26.12 ; port CFG_2v5IO_A.FPGA_GPIO2V5_19
FPGA_CFG2V5_IO_20: R26.13 ; port CFG_2v5IO_A.FPGA_GPIO2V5_20
FPGA_CFG2V5_IO_21: R26.14 ; port CFG_2v5IO_A.FPGA_GPIO2V5_21
FPGA_CFG2V5_IO_22: R26.15 ; port CFG_2v5IO_A.FPGA_GPIO2V5_22
FPGA_CFG2V5_IO_23: R26.16 ; port CFG_2v5IO_A.FPGA_GPIO2V5_23
FPGA_CFG2V5_IO_24: R20.8 ; port CFG_2v5IO_B.FPGA_GPIO2V5_0
FPGA_CFG2V5_IO_25: R20.7 ; port CFG_2v5IO_B.FPGA_GPIO2V5_1
FPGA_CFG2V5_IO_26: R20.6 ; port CFG_2v5IO_B.FPGA_GPIO2V5_2
FPGA_CFG2V5_IO_27: R20.5 ; port CFG_2v5IO_B.FPGA_GPIO2V5_3
FPGA_CFG2V5_IO_28: R20.4 ; port CFG_2v5IO_B.FPGA_GPIO2V5_4
FPGA_CFG2V5_IO_29: R20.3 ; port CFG_2v5IO_B.FPGA_GPIO2V5_5
FPGA_CFG2V5_IO_30: R20.2 ; port CFG_2v5IO_B.FPGA_GPIO2V5_6
FPGA_CFG2V5_IO_31: R20.1 ; port CFG_2v5IO_B.FPGA_GPIO2V5_7
FPGA_CFG2V5_IO_R_0: R29.8 X2.43
FPGA_CFG2V5_IO_R_1: R29.7 X2.45
FPGA_CFG2V5_IO_R_2: R29.6 X2.47
FPGA_CFG2V5_IO_R_3: R29.5 X2.49
FPGA_CFG2V5_IO_R_4: R29.4 X2.53
FPGA_CFG2V5_IO_R_5: R29.3 X2.55
FPGA_CFG2V5_IO_R_6: R29.2 X2.57
FPGA_CFG2V5_IO_R_7: R29.1 X2.59
FPGA_CFG2V5_IO_R_8: R21.8 X2.63
FPGA_CFG2V5_IO_R_9: R21.7 X2.65
FPGA_CFG2V5_IO_R_10: R21.6 X2.67
FPGA_CFG2V5_IO_R_11: R21.5 X2.69
FPGA_CFG2V5_IO_R_12: R21.4 X2.73
FPGA_CFG2V5_IO_R_13: R21.3 X2.75
FPGA_CFG2V5_IO_R_14: R21.2 X2.77
FPGA_CFG2V5_IO_R_15: R21.1 X2.79
FPGA_CFG2V5_IO_R_16: R26.8 X2.46
FPGA_CFG2V5_IO_R_17: R26.7 X2.48
FPGA_CFG2V5_IO_R_18: R26.6 X2.50
FPGA_CFG2V5_IO_R_19: R26.5 X2.52
FPGA_CFG2V5_IO_R_20: R26.4 X2.56
FPGA_CFG2V5_IO_R_21: R26.3 X2.58
FPGA_CFG2V5_IO_R_22: R26.2 X2.60
FPGA_CFG2V5_IO_R_23: R26.1 X2.62
FPGA_CFG2V5_IO_R_24: R20.9 X2.96
FPGA_CFG2V5_IO_R_25: R20.10 X2.100
FPGA_CFG2V5_IO_R_26: R20.11 X2.104
FPGA_CFG2V5_IO_R_27: R20.12 X2.108
FPGA_CFG2V5_IO_R_28: R20.13 X2.112
FPGA_CFG2V5_IO_R_29: R20.14 X2.116
FPGA_CFG2V5_IO_R_30: R20.15 X2.120
FPGA_CFG2V5_IO_R_31: R20.16 X2.124
LVDS0_CKO_N: X2.38 ; port LVDS0_TX_x4.LVDS_TX_CK_P
LVDS0_CKO_P: X2.42 ; port LVDS0_TX_x4.LVDS_TX_CK_N
LVDS0_TX0_N: X2.30 ; port LVDS0_TX_x4.LVDS_TX_0_P
LVDS0_TX0_P: X2.34 ; port LVDS0_TX_x4.LVDS_TX_0_N
LVDS0_TX1_N: X2.22 ; port LVDS0_TX_x4.LVDS_TX_1_P
LVDS0_TX1_P: X2.26 ; port LVDS0_TX_x4.LVDS_TX_1_N
LVDS0_TX2_N: X2.14 ; port LVDS0_TX_x4.LVDS_TX_2_P
LVDS0_TX2_P: X2.18 ; port LVDS0_TX_x4.LVDS_TX_2_N
LVDS0_TX3_N: X2.6 ; port LVDS0_TX_x4.LVDS_TX_3_P
LVDS0_TX3_P: X2.10 ; port LVDS0_TX_x4.LVDS_TX_3_N
MIPI_CSI-2_A_CK24_2v5: R27.2(-) ; port MIPI_CLK24_2v5.A
MIPI_CSI-2_A_I2C_CL_2v5: R30.2(-) ; port MIPI_I2C.A_CL
MIPI_CSI-2_A_I2C_DA_2v5: R28.2(-) ; port MIPI_I2C.A_DA
MIPI_CSI-2_B_CK24_2v5: R31.2(-) ; port MIPI_CLK24_2v5.B
MIPI_CSI-2_B_I2C_CL_2v5: R33.2(-) ; port MIPI_I2C.B_CL
MIPI_CSI-2_B_I2C_DA_2v5: R32.2(-) ; port MIPI_I2C.B_DA
MIPI_CSI_CLKA_P: X2.129 ; port MIPI_CSI-2_A.MIPI_CSI_CK_P
MIPI_CSI_CLKB_N: X2.39 ; port MIPI_CSI-2_B.MIPI_CSI_CK_N
MIPI_CSI_CLKB_P: X2.35 ; port MIPI_CSI-2_B.MIPI_CSI_CK_P
MIPI_CSI_DA0_N: X2.117 ; port MIPI_CSI-2_A.MIPI_CSI_D0_N
MIPI_CSI_DA0_P: X2.121 ; port MIPI_CSI-2_A.MIPI_CSI_D0_P
MIPI_CSI_DA1_N: X2.109 ; port MIPI_CSI-2_A.MIPI_CSI_D1_N
MIPI_CSI_DA1_P: X2.113 ; port MIPI_CSI-2_A.MIPI_CSI_D1_P
MIPI_CSI_DA2_N: X2.101 ; port MIPI_CSI-2_A.MIPI_CSI_D2_N
MIPI_CSI_DA2_P: X2.105 ; port MIPI_CSI-2_A.MIPI_CSI_D2_P
MIPI_CSI_DA3_N: X2.93 ; port MIPI_CSI-2_A.MIPI_CSI_D3_N
MIPI_CSI_DA3_P: X2.97 ; port MIPI_CSI-2_A.MIPI_CSI_D3_P
MIPI_CSI_DB0_N: X2.7 ; port MIPI_CSI-2_B.MIPI_CSI_D0_N
MIPI_CSI_DB0_P: X2.3 ; port MIPI_CSI-2_B.MIPI_CSI_D0_P
MIPI_CSI_DB1_N: X2.15 ; port MIPI_CSI-2_B.MIPI_CSI_D1_N
MIPI_CSI_DB1_P: X2.11 ; port MIPI_CSI-2_B.MIPI_CSI_D1_P
MIPI_CSI_DB2_N: X2.23 ; port MIPI_CSI-2_B.MIPI_CSI_D2_N
MIPI_CSI_DB2_P: X2.19 ; port MIPI_CSI-2_B.MIPI_CSI_D2_P
MIPI_CSI_DB3_N: X2.31 ; port MIPI_CSI-2_B.MIPI_CSI_D3_N
MIPI_CSI_DB3_P: X2.27 ; port MIPI_CSI-2_B.MIPI_CSI_D3_P
NetR27_1: R27.1(+) X2.66
NetR28_1: R28.1(+) X2.68
NetR30_1: R30.1(+) X2.70
NetR31_1: R31.1(+) X2.72
NetR32_1: R32.1(+) X2.74
NetR33_1: R33.1(+) X2.76

Not connected (* = marked no-connect by the designer): X2 128 130 132 133 134 135 136 137 138 139 140 141 142

### Layout directives
differential pair: LVDS0_CKO_N, LVDS0_CKO_P, LVDS0_TX0_N, LVDS0_TX0_P, LVDS0_TX1_N, LVDS0_TX1_P, LVDS0_TX2_N, LVDS0_TX2_P, LVDS0_TX3_N, LVDS0_TX3_P, MIPI_CSI_CLKA_N, MIPI_CSI_CLKA_P, MIPI_CSI_CLKB_N, MIPI_CSI_CLKB_P, MIPI_CSI_DA0_N, MIPI_CSI_DA0_P, MIPI_CSI_DA1_N, MIPI_CSI_DA1_P, MIPI_CSI_DA2_N, MIPI_CSI_DA2_P, MIPI_CSI_DA3_N, MIPI_CSI_DA3_P, MIPI_CSI_DB0_N, MIPI_CSI_DB0_P, MIPI_CSI_DB1_N, MIPI_CSI_DB1_P, MIPI_CSI_DB2_N, MIPI_CSI_DB2_P, MIPI_CSI_DB3_N, MIPI_CSI_DB3_P

### Notes on the sheet
- Form connector C
- (in symbol CR0402-#-±5%) 0402

### Library data of the parts
R20 R21 R26 R29 = YC248-JR-07-#: Набор чип резисторов; P: 0.062 Вт; Supplier 1: Digi-Key; Supplier Part Number 1: YC248-JR-0722RL
R27 R28 R30-R33 = CR0402-#-±5%: as R43 on sheet FPGA_DDR3&IO; Supplier 1: Digi-Key; Supplier Part Number 1: 311-10.0KLRDKR-ND